# EAGLE schematic backplane (EAGLE 6.6.0)
AUTHOR: Pat Pannuto; REV: B; TITLE: Signpost Backplane

## Sheet 1 of 9
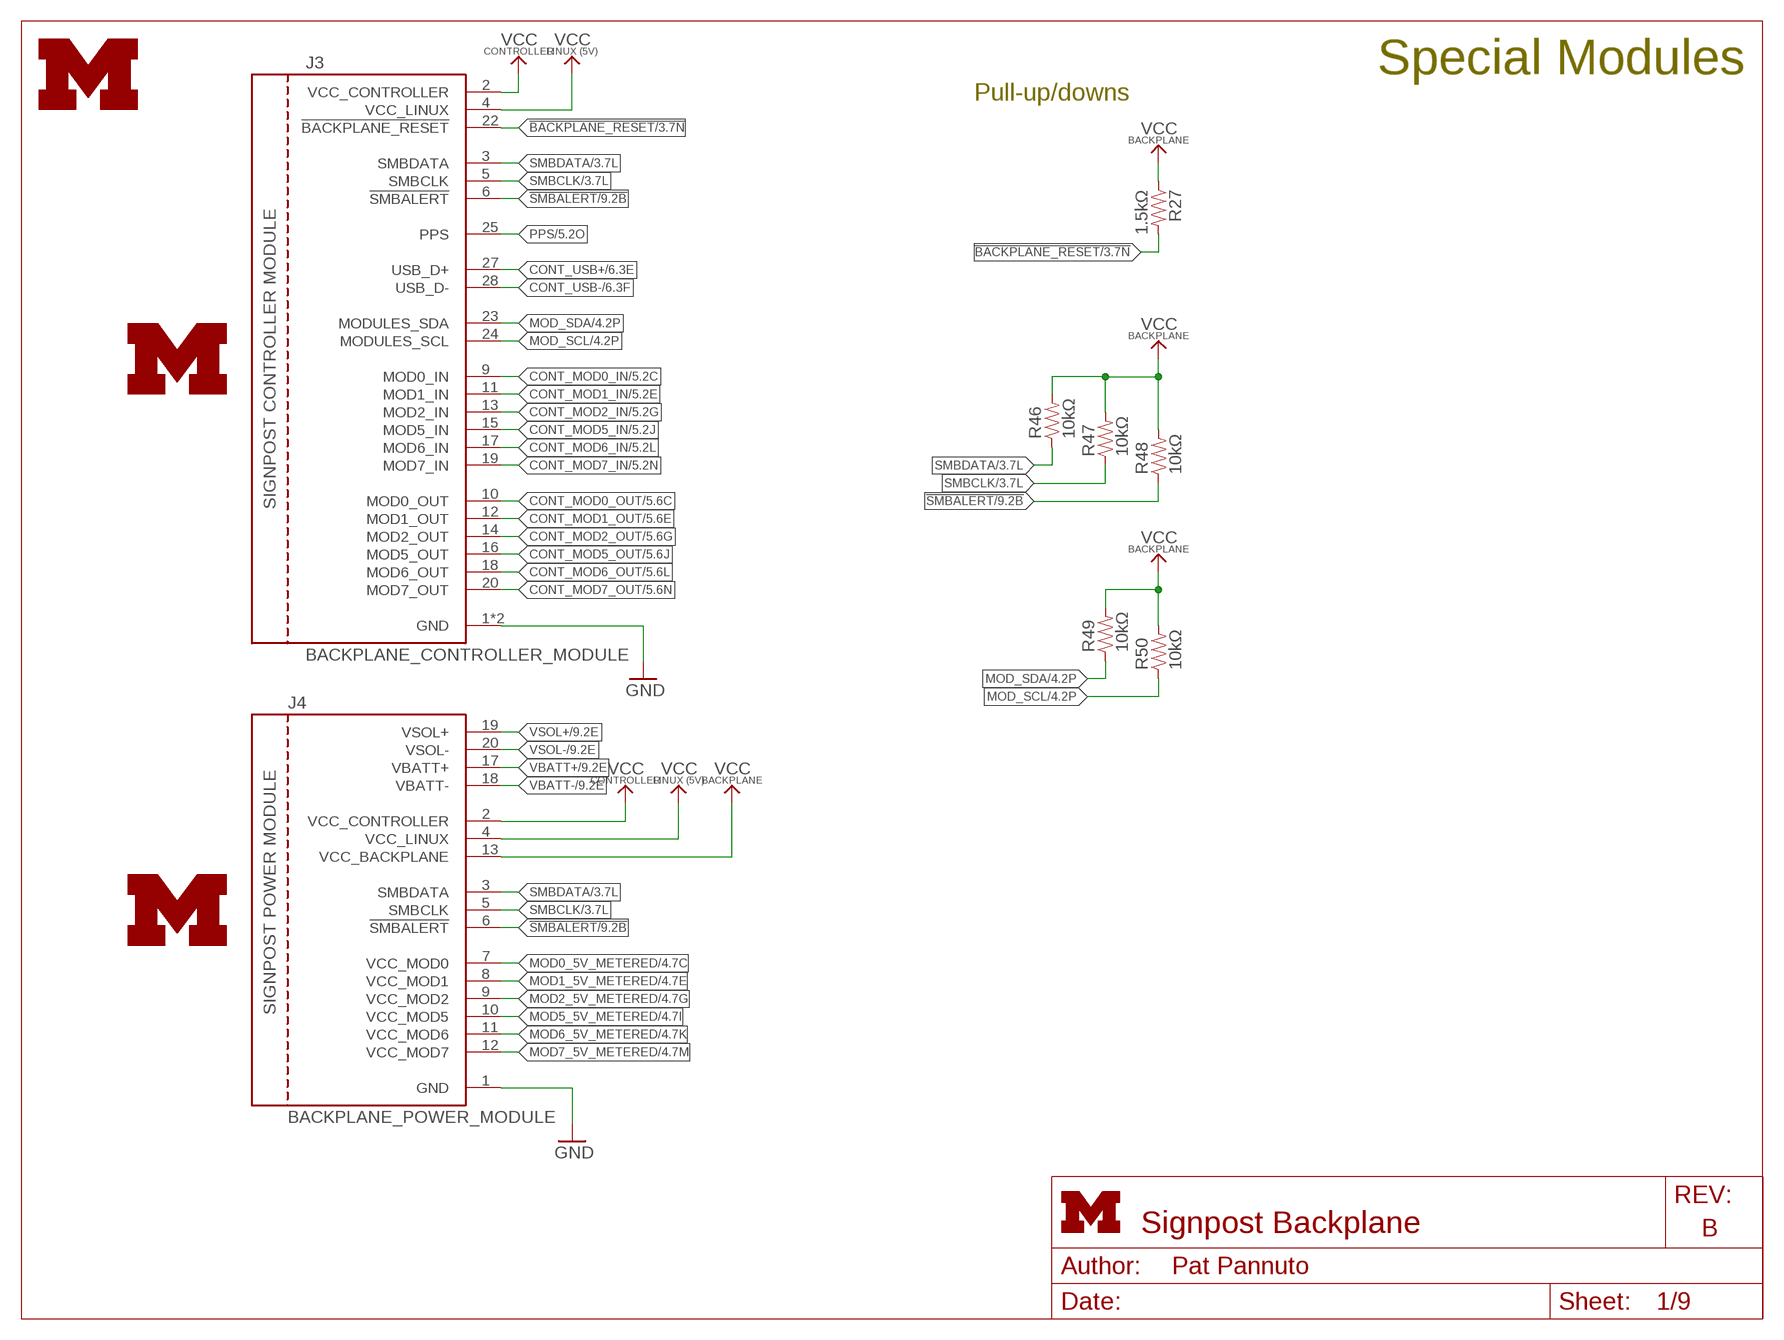
[diagram p0: schematic, sheet 1]
FRAME1 (LETTER_L): HEIGHT: 8.5in; WIDTH: 11in

### Parts
J3  BACKPLANE_CONTROLLER_MODULE  [BACKPLANE_MODULE_20PIN_10PIN]
J4  BACKPLANE_POWER_MODULE  [BACKPLANE_MODULE_20PIN]
LOGO1  UMICH_SOLID_GIANT  [UMICH_SOLID_1000MIL]
LOGO8  UMICH_SOLID_MEDIUM  [UMICH_SOLID_200MIL]
LOGO9  UMICH_SOLID_MEDIUM  [UMICH_SOLID_200MIL]
R27  1.5kΩ  RESISTOR0603_RES  [0603-RES]
R46  10kΩ  RESISTOR0603_RES  [0603-RES]
R47  10kΩ  RESISTOR0603_RES  [0603-RES]
R48  10kΩ  RESISTOR0603_RES  [0603-RES]
R49  10kΩ  RESISTOR0603_RES  [0603-RES]
R50  10kΩ  RESISTOR0603_RES  [0603-RES]

### Nets
!BACKPLANE_RESET: J3.22(!BACKPLANE_RESET) R27.2 ; also sheet 3,6,9
!SMBALERT: J3.6(!SMBALERT) J4.6(!SMBALERT) R48.1 ; also sheet 9
CONT_MOD0_IN: J3.9(MOD0_IN) ; also sheet 5
CONT_MOD0_OUT: J3.10(MOD0_OUT) ; also sheet 5
CONT_MOD1_IN: J3.11(MOD1_IN) ; also sheet 5
CONT_MOD1_OUT: J3.12(MOD1_OUT) ; also sheet 5
CONT_MOD2_IN: J3.13(MOD2_IN) ; also sheet 5
CONT_MOD2_OUT: J3.14(MOD2_OUT) ; also sheet 5
CONT_MOD5_IN: J3.15(MOD5_IN) ; also sheet 5
CONT_MOD5_OUT: J3.16(MOD5_OUT) ; also sheet 5
CONT_MOD6_IN: J3.17(MOD6_IN) ; also sheet 5
CONT_MOD6_OUT: J3.18(MOD6_OUT) ; also sheet 5
CONT_MOD7_IN: J3.19(MOD7_IN) ; also sheet 5
CONT_MOD7_OUT: J3.20(MOD7_OUT) ; also sheet 5
CONT_USB+: J3.27(USB_D+) ; also sheet 6
CONT_USB-: J3.28(USB_D-) ; also sheet 6
GND: J3.1(GND) J3.21(GND) J4.1(GND) ; also sheet 2,3,4,5,6,7,8,9
MOD0_5V_METERED: J4.7(VCC_MOD0) ; also sheet 4,8,9
MOD1_5V_METERED: J4.8(VCC_MOD1) ; also sheet 4,8,9
MOD2_5V_METERED: J4.9(VCC_MOD2) ; also sheet 4,8,9
MOD5_5V_METERED: J4.10(VCC_MOD5) ; also sheet 4,8,9
MOD6_5V_METERED: J4.11(VCC_MOD6) ; also sheet 4,8,9
MOD7_5V_METERED: J4.12(VCC_MOD7) ; also sheet 4,8,9
MOD_SCL: J3.24(MODULES_SCL) R50.1 ; also sheet 4,9
MOD_SDA: J3.23(MODULES_SDA) R49.1 ; also sheet 4,9
PPS: J3.25(PPS) ; also sheet 5,9
SMBCLK: J3.5(SMBCLK) J4.5(SMBCLK) R47.1 ; also sheet 3,9
SMBDATA: J3.3(SMBDATA) J4.3(SMBDATA) R46.1 ; also sheet 3,9
VBATT+: J4.17(VBATT+) ; also sheet 9
VBATT-: J4.18(VBATT-) ; also sheet 9
VCC_BACKPLANE: J4.13(VCC_BACKPLANE) R27.1 R46.2 R47.2 R48.2 R49.2 R50.2 ; also sheet 3,4,5,6,7,8,9
VCC_CONTROLLER: J3.2(VCC_CONTROLLER) J4.2(VCC_CONTROLLER) ; also sheet 9
VCC_LINUX: J3.4(VCC_LINUX) J4.4(VCC_LINUX) ; also sheet 9
VSOL+: J4.19(VSOL+) ; also sheet 9
VSOL-: J4.20(VSOL-) ; also sheet 9

### Notes on the sheet
- Special Modules
- Pull-up/downs

## Sheet 2 of 9
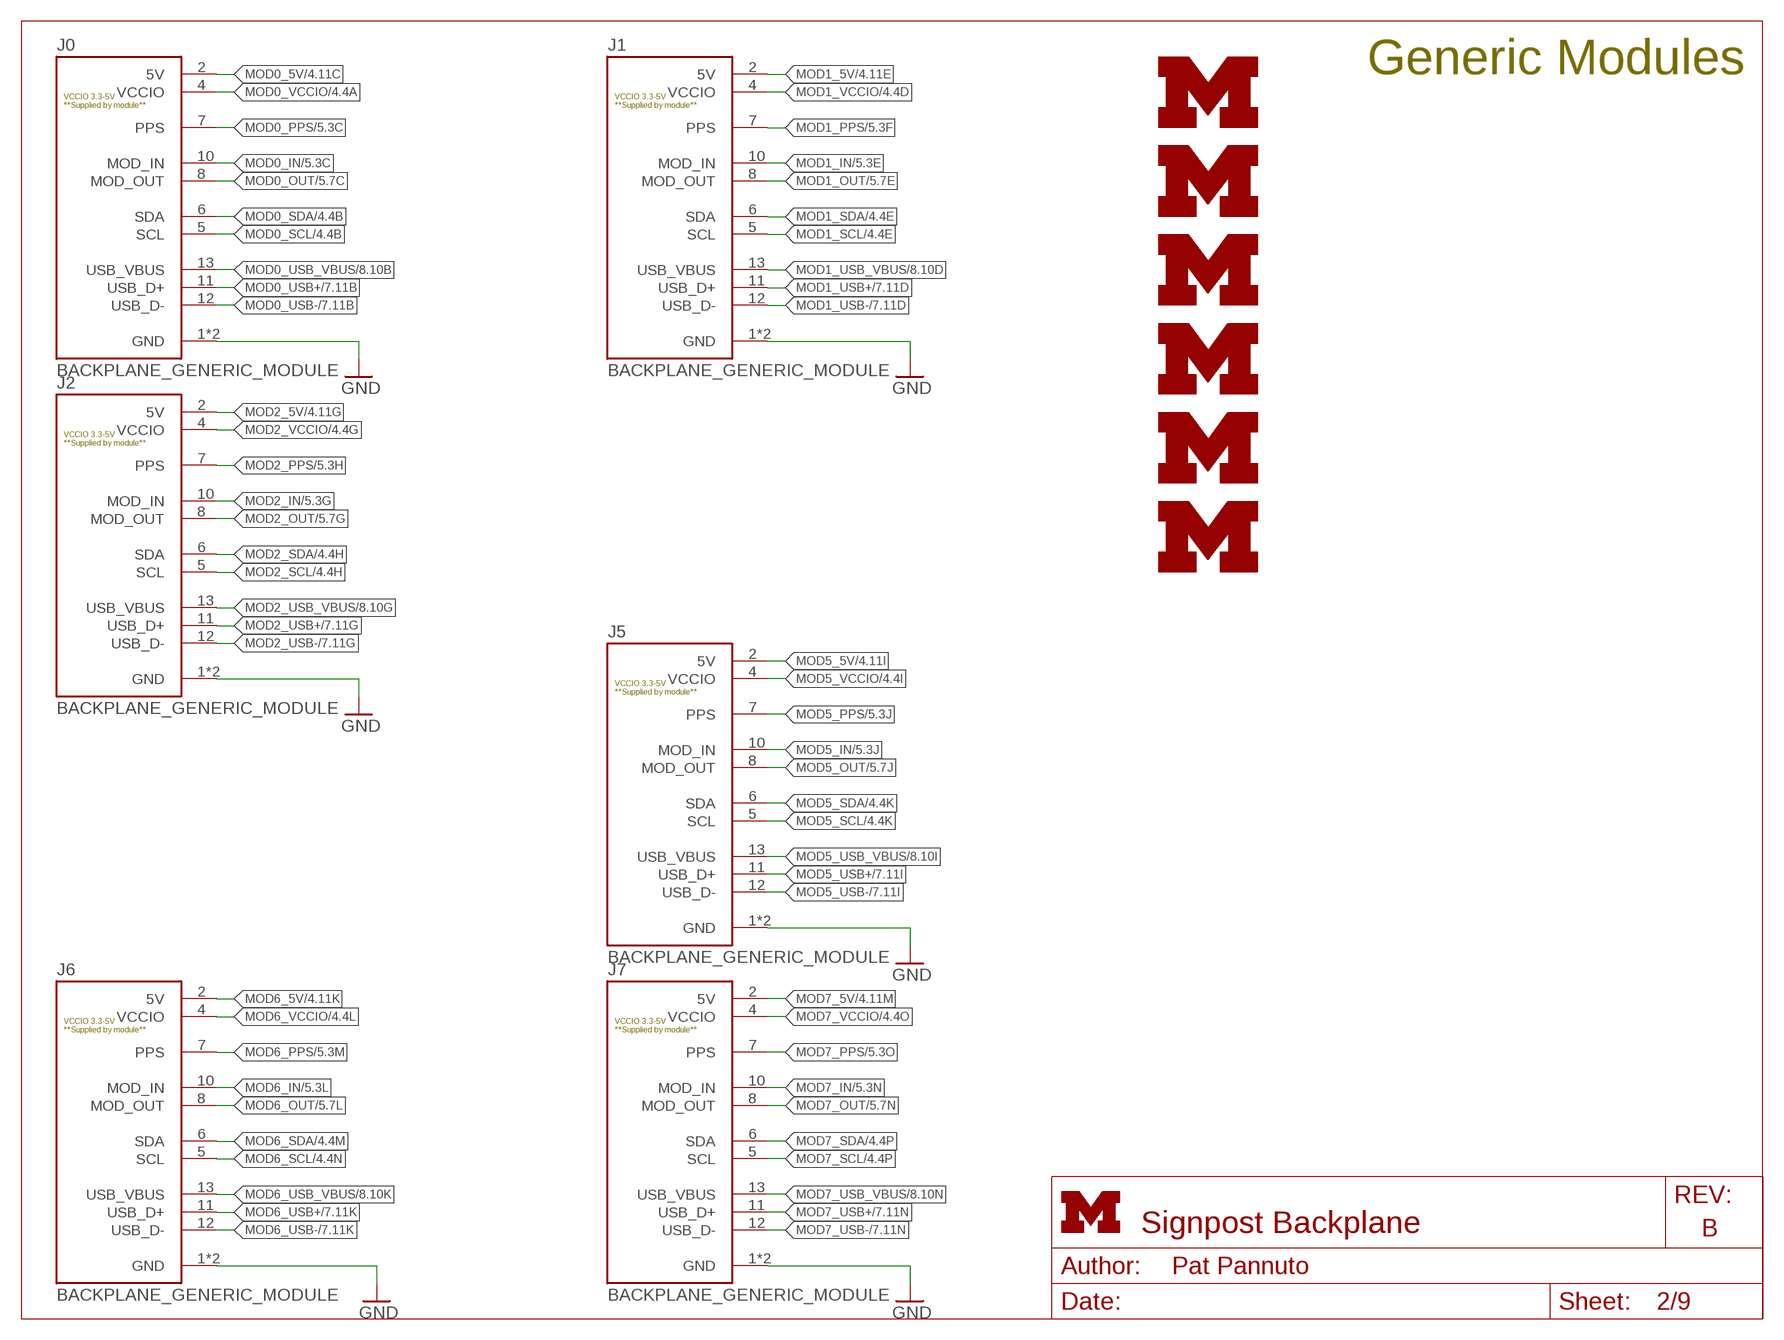
[diagram p1: schematic, sheet 2]
FRAME2 (LETTER_L): HEIGHT: 8.5in; WIDTH: 11in

### Parts
J0  BACKPLANE_GENERIC_MODULE  [BACKPLANE_MODULE_14PIN]
J1  BACKPLANE_GENERIC_MODULE  [BACKPLANE_MODULE_14PIN]
J2  BACKPLANE_GENERIC_MODULE  [BACKPLANE_MODULE_14PIN]
J5  BACKPLANE_GENERIC_MODULE  [BACKPLANE_MODULE_14PIN]
J6  BACKPLANE_GENERIC_MODULE  [BACKPLANE_MODULE_14PIN]
J7  BACKPLANE_GENERIC_MODULE  [BACKPLANE_MODULE_14PIN]
LOGO2  UMICH_SOLID_MEDIUM  [UMICH_SOLID_200MIL]
LOGO3  UMICH_SOLID_MEDIUM  [UMICH_SOLID_200MIL]
LOGO4  UMICH_SOLID_MEDIUM  [UMICH_SOLID_200MIL]
LOGO5  UMICH_SOLID_MEDIUM  [UMICH_SOLID_200MIL]
LOGO6  UMICH_SOLID_MEDIUM  [UMICH_SOLID_200MIL]
LOGO7  UMICH_SOLID_MEDIUM  [UMICH_SOLID_200MIL]

### Nets
GND: J0.1(GND) J0.14(GND) J1.1(GND) J1.14(GND) J2.1(GND) J2.14(GND) J5.1(GND) J5.14(GND) J6.1(GND) J6.14(GND) J7.1(GND) J7.14(GND) ; also sheet 1,3,4,5,6,7,8,9
MOD0_5V: J0.2(5V) ; also sheet 4
MOD0_IN: J0.10(MOD_IN) ; also sheet 5
MOD0_OUT: J0.8(MOD_OUT) ; also sheet 5
MOD0_PPS: J0.7(PPS) ; also sheet 5
MOD0_SCL: J0.5(SCL) ; also sheet 4
MOD0_SDA: J0.6(SDA) ; also sheet 4
MOD0_USB+: J0.11(USB_D+) ; also sheet 7
MOD0_USB-: J0.12(USB_D-) ; also sheet 7
MOD0_USB_VBUS: J0.13(USB_VBUS) ; also sheet 8
MOD0_VCCIO: J0.4(VCCIO) ; also sheet 4,5
MOD1_5V: J1.2(5V) ; also sheet 4
MOD1_IN: J1.10(MOD_IN) ; also sheet 5
MOD1_OUT: J1.8(MOD_OUT) ; also sheet 5
MOD1_PPS: J1.7(PPS) ; also sheet 5
MOD1_SCL: J1.5(SCL) ; also sheet 4
MOD1_SDA: J1.6(SDA) ; also sheet 4
MOD1_USB+: J1.11(USB_D+) ; also sheet 7
MOD1_USB-: J1.12(USB_D-) ; also sheet 7
MOD1_USB_VBUS: J1.13(USB_VBUS) ; also sheet 8
MOD1_VCCIO: J1.4(VCCIO) ; also sheet 4,5
MOD2_5V: J2.2(5V) ; also sheet 4
MOD2_IN: J2.10(MOD_IN) ; also sheet 5
MOD2_OUT: J2.8(MOD_OUT) ; also sheet 5
MOD2_PPS: J2.7(PPS) ; also sheet 5
MOD2_SCL: J2.5(SCL) ; also sheet 4
MOD2_SDA: J2.6(SDA) ; also sheet 4
MOD2_USB+: J2.11(USB_D+) ; also sheet 7
MOD2_USB-: J2.12(USB_D-) ; also sheet 7
MOD2_USB_VBUS: J2.13(USB_VBUS) ; also sheet 8
MOD2_VCCIO: J2.4(VCCIO) ; also sheet 4,5
MOD5_5V: J5.2(5V) ; also sheet 4
MOD5_IN: J5.10(MOD_IN) ; also sheet 5
MOD5_OUT: J5.8(MOD_OUT) ; also sheet 5
MOD5_PPS: J5.7(PPS) ; also sheet 5
MOD5_SCL: J5.5(SCL) ; also sheet 4
MOD5_SDA: J5.6(SDA) ; also sheet 4
MOD5_USB+: J5.11(USB_D+) ; also sheet 7
MOD5_USB-: J5.12(USB_D-) ; also sheet 7
MOD5_USB_VBUS: J5.13(USB_VBUS) ; also sheet 8
MOD5_VCCIO: J5.4(VCCIO) ; also sheet 4,5
MOD6_5V: J6.2(5V) ; also sheet 4
MOD6_IN: J6.10(MOD_IN) ; also sheet 5
MOD6_OUT: J6.8(MOD_OUT) ; also sheet 5
MOD6_PPS: J6.7(PPS) ; also sheet 5
MOD6_SCL: J6.5(SCL) ; also sheet 4
MOD6_SDA: J6.6(SDA) ; also sheet 4
MOD6_USB+: J6.11(USB_D+) ; also sheet 7
MOD6_USB-: J6.12(USB_D-) ; also sheet 7
MOD6_USB_VBUS: J6.13(USB_VBUS) ; also sheet 8
MOD6_VCCIO: J6.4(VCCIO) ; also sheet 4,5
MOD7_5V: J7.2(5V) ; also sheet 4
MOD7_IN: J7.10(MOD_IN) ; also sheet 5
MOD7_OUT: J7.8(MOD_OUT) ; also sheet 5
MOD7_PPS: J7.7(PPS) ; also sheet 5
MOD7_SCL: J7.5(SCL) ; also sheet 4
MOD7_SDA: J7.6(SDA) ; also sheet 4
MOD7_USB+: J7.11(USB_D+) ; also sheet 7
MOD7_USB-: J7.12(USB_D-) ; also sheet 7
MOD7_USB_VBUS: J7.13(USB_VBUS) ; also sheet 8
MOD7_VCCIO: J7.4(VCCIO) ; also sheet 4,5

### Notes on the sheet
- Generic Modules

## Sheet 3 of 9
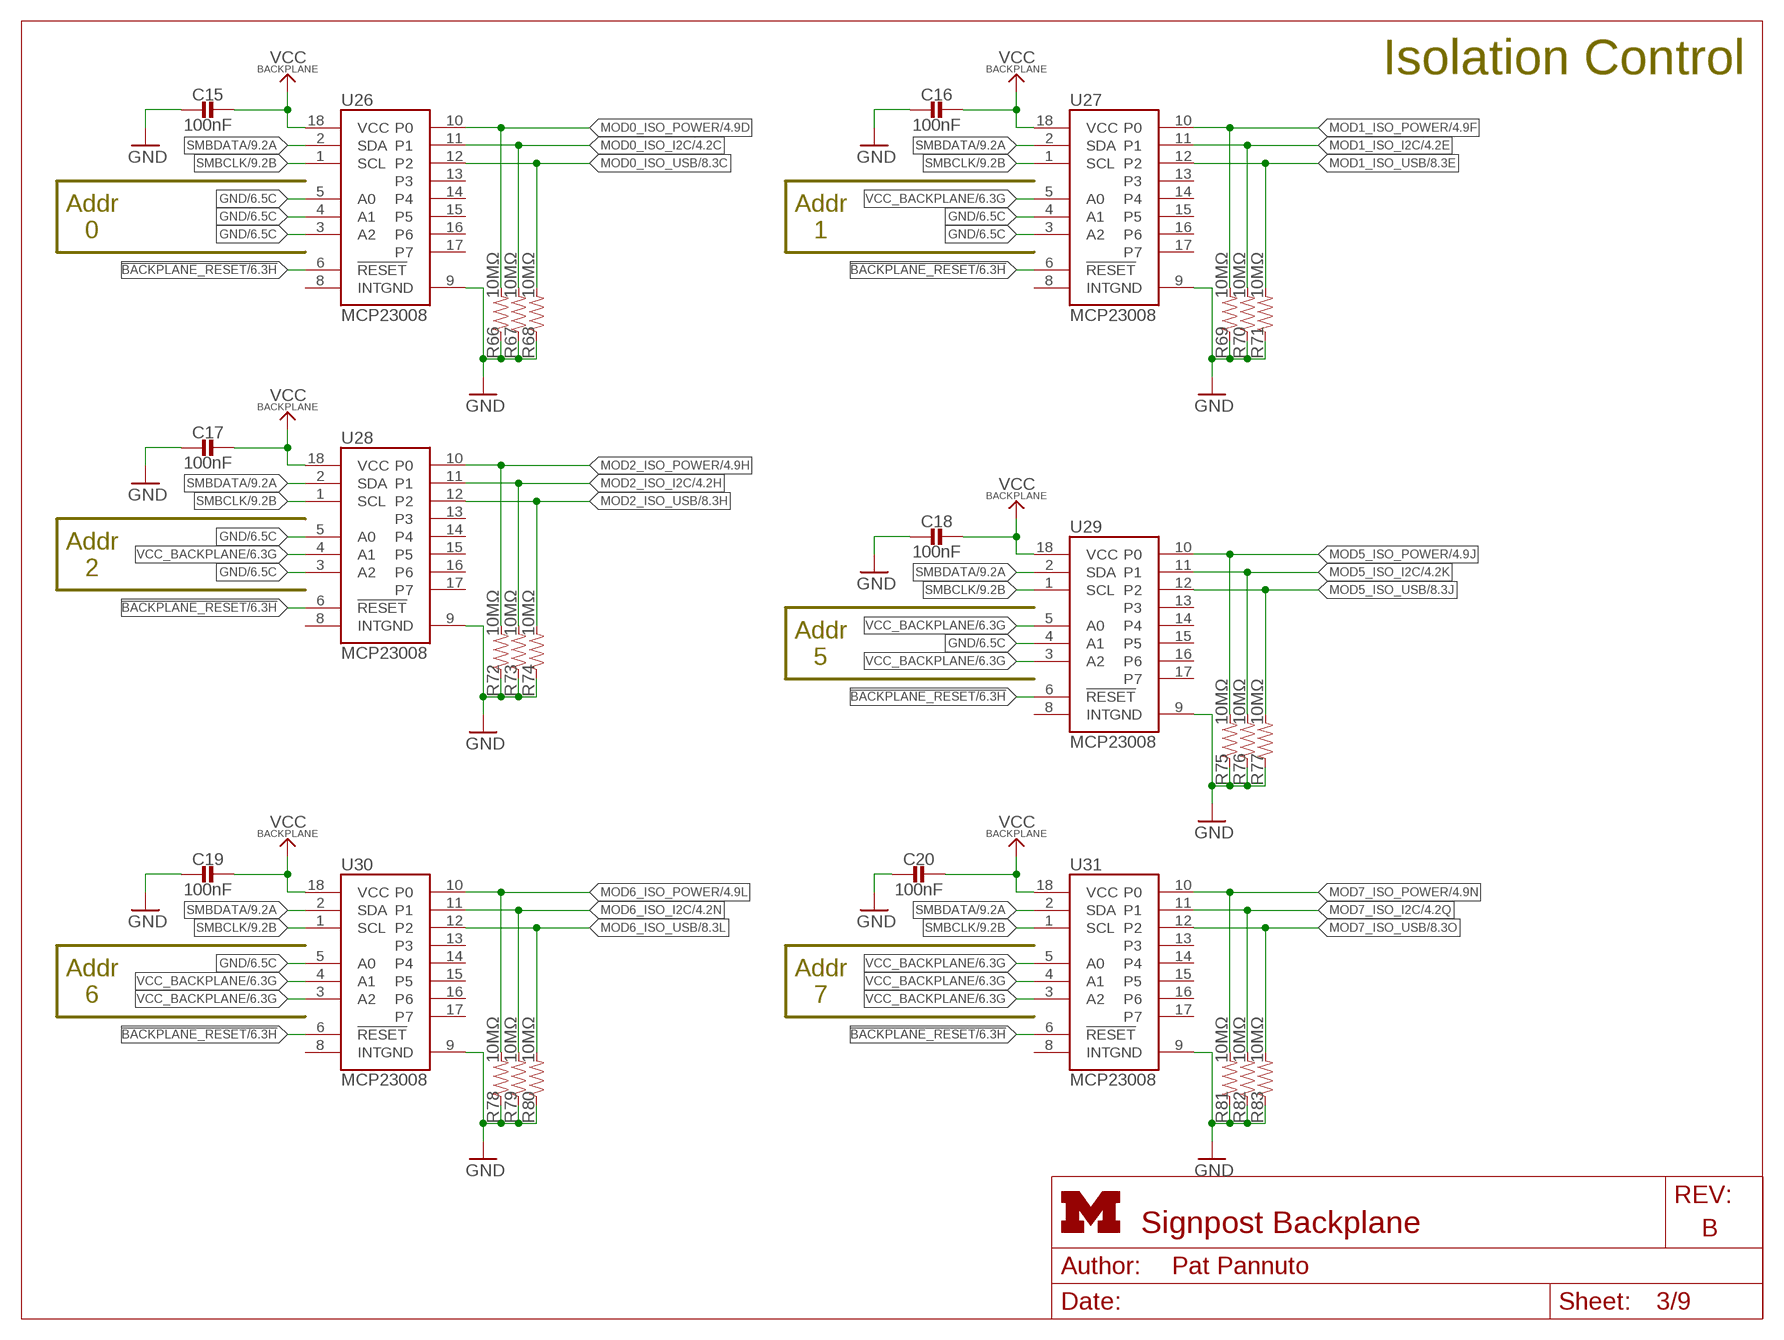
[diagram p2: schematic, sheet 3]
FRAME7 (LETTER_L_UMICH): HEIGHT: 8.5in; WIDTH: 11in

### Parts
C15  100nF  CAPACITOR0603_CAP  [0603_CAP]
C16  100nF  CAPACITOR0603_CAP  [0603_CAP]
C17  100nF  CAPACITOR0603_CAP  [0603_CAP]
C18  100nF  CAPACITOR0603_CAP  [0603_CAP]
C19  100nF  CAPACITOR0603_CAP  [0603_CAP]
C20  100nF  CAPACITOR0603_CAP  [0603_CAP]
R66  10MΩ  RESISTOR0603_RES  [0603-RES]
R67  10MΩ  RESISTOR0603_RES  [0603-RES]
R68  10MΩ  RESISTOR0603_RES  [0603-RES]
R69  10MΩ  RESISTOR0603_RES  [0603-RES]
R70  10MΩ  RESISTOR0603_RES  [0603-RES]
R71  10MΩ  RESISTOR0603_RES  [0603-RES]
R72  10MΩ  RESISTOR0603_RES  [0603-RES]
R73  10MΩ  RESISTOR0603_RES  [0603-RES]
R74  10MΩ  RESISTOR0603_RES  [0603-RES]
R75  10MΩ  RESISTOR0603_RES  [0603-RES]
R76  10MΩ  RESISTOR0603_RES  [0603-RES]
R77  10MΩ  RESISTOR0603_RES  [0603-RES]
R78  10MΩ  RESISTOR0603_RES  [0603-RES]
R79  10MΩ  RESISTOR0603_RES  [0603-RES]
R80  10MΩ  RESISTOR0603_RES  [0603-RES]
R81  10MΩ  RESISTOR0603_RES  [0603-RES]
R82  10MΩ  RESISTOR0603_RES  [0603-RES]
R83  10MΩ  RESISTOR0603_RES  [0603-RES]
U26  MCP23008  [SOIC-18]
U27  MCP23008  [SOIC-18]
U28  MCP23008  [SOIC-18]
U29  MCP23008  [SOIC-18]
U30  MCP23008  [SOIC-18]
U31  MCP23008  [SOIC-18]

### Nets
!BACKPLANE_RESET: U26.6(!RESET) U27.6(!RESET) U28.6(!RESET) U29.6(!RESET) U30.6(!RESET) U31.6(!RESET) ; also sheet 1,6,9
GND: C15.2 C16.2 C17.2 C18.2 C19.2 C20.2 R66.1 R67.1 R68.1 R69.1 R70.1 R71.1 R72.1 R73.1 R74.1 R75.1 R76.1 R77.1 R78.1 R79.1 R80.1 R81.1 R82.1 R83.1 U26.3(A2) U26.4(A1) U26.5(A0) U26.9(GND) U27.3(A2) U27.4(A1) U27.9(GND) U28.3(A2) U28.5(A0) U28.9(GND) U29.4(A1) U29.9(GND) U30.5(A0) U30.9(GND) U31.9(GND) ; also sheet 1,2,4,5,6,7,8,9
MOD0_ISO_I2C: R67.2 U26.11(P1) ; also sheet 4,9
MOD0_ISO_POWER: R66.2 U26.10(P0) ; also sheet 4,9
MOD0_ISO_USB: R68.2 U26.12(P2) ; also sheet 8,9
MOD1_ISO_I2C: R70.2 U27.11(P1) ; also sheet 4,9
MOD1_ISO_POWER: R69.2 U27.10(P0) ; also sheet 4,9
MOD1_ISO_USB: R71.2 U27.12(P2) ; also sheet 8,9
MOD2_ISO_I2C: R73.2 U28.11(P1) ; also sheet 4,9
MOD2_ISO_POWER: R72.2 U28.10(P0) ; also sheet 4,9
MOD2_ISO_USB: R74.2 U28.12(P2) ; also sheet 8,9
MOD5_ISO_I2C: R76.2 U29.11(P1) ; also sheet 4,9
MOD5_ISO_POWER: R75.2 U29.10(P0) ; also sheet 4,9
MOD5_ISO_USB: R77.2 U29.12(P2) ; also sheet 8,9
MOD6_ISO_I2C: R79.2 U30.11(P1) ; also sheet 4,9
MOD6_ISO_POWER: R78.2 U30.10(P0) ; also sheet 4,9
MOD6_ISO_USB: R80.2 U30.12(P2) ; also sheet 8,9
MOD7_ISO_I2C: R82.2 U31.11(P1) ; also sheet 4,9
MOD7_ISO_POWER: R81.2 U31.10(P0) ; also sheet 4,9
MOD7_ISO_USB: R83.2 U31.12(P2) ; also sheet 8,9
SMBCLK: U26.1(SCL) U27.1(SCL) U28.1(SCL) U29.1(SCL) U30.1(SCL) U31.1(SCL) ; also sheet 1,9
SMBDATA: U26.2(SDA) U27.2(SDA) U28.2(SDA) U29.2(SDA) U30.2(SDA) U31.2(SDA) ; also sheet 1,9
VCC_BACKPLANE: C15.1 C16.1 C17.1 C18.1 C19.1 C20.1 U26.18(VCC) U27.5(A0) U27.18(VCC) U28.4(A1) U28.18(VCC) U29.3(A2) U29.5(A0) U29.18(VCC) U30.3(A2) U30.4(A1) U30.18(VCC) U31.3(A2) U31.4(A1) U31.5(A0) U31.18(VCC) ; also sheet 1,4,5,6,7,8,9
Unconnected: U26.8(INT) U26.13(P3) U26.14(P4) U26.15(P5) U26.16(P6) U26.17(P7) U27.8(INT) U27.13(P3) U27.14(P4) U27.15(P5) U27.16(P6) U27.17(P7) U28.8(INT) U28.13(P3) U28.14(P4) U28.15(P5) U28.16(P6) U28.17(P7) U29.8(INT) U29.13(P3) U29.14(P4) U29.15(P5) U29.16(P6) U29.17(P7) U30.8(INT) U30.13(P3) U30.14(P4) U30.15(P5) U30.16(P6) U30.17(P7) U31.8(INT) U31.13(P3) U31.14(P4) U31.15(P5) U31.16(P6) U31.17(P7)

### Notes on the sheet
- Isolation Control
- Addr
  0
- Addr
  1
- Addr
  2
- Addr
  5
- Addr
  6
- Addr
  7

## Sheet 4 of 9
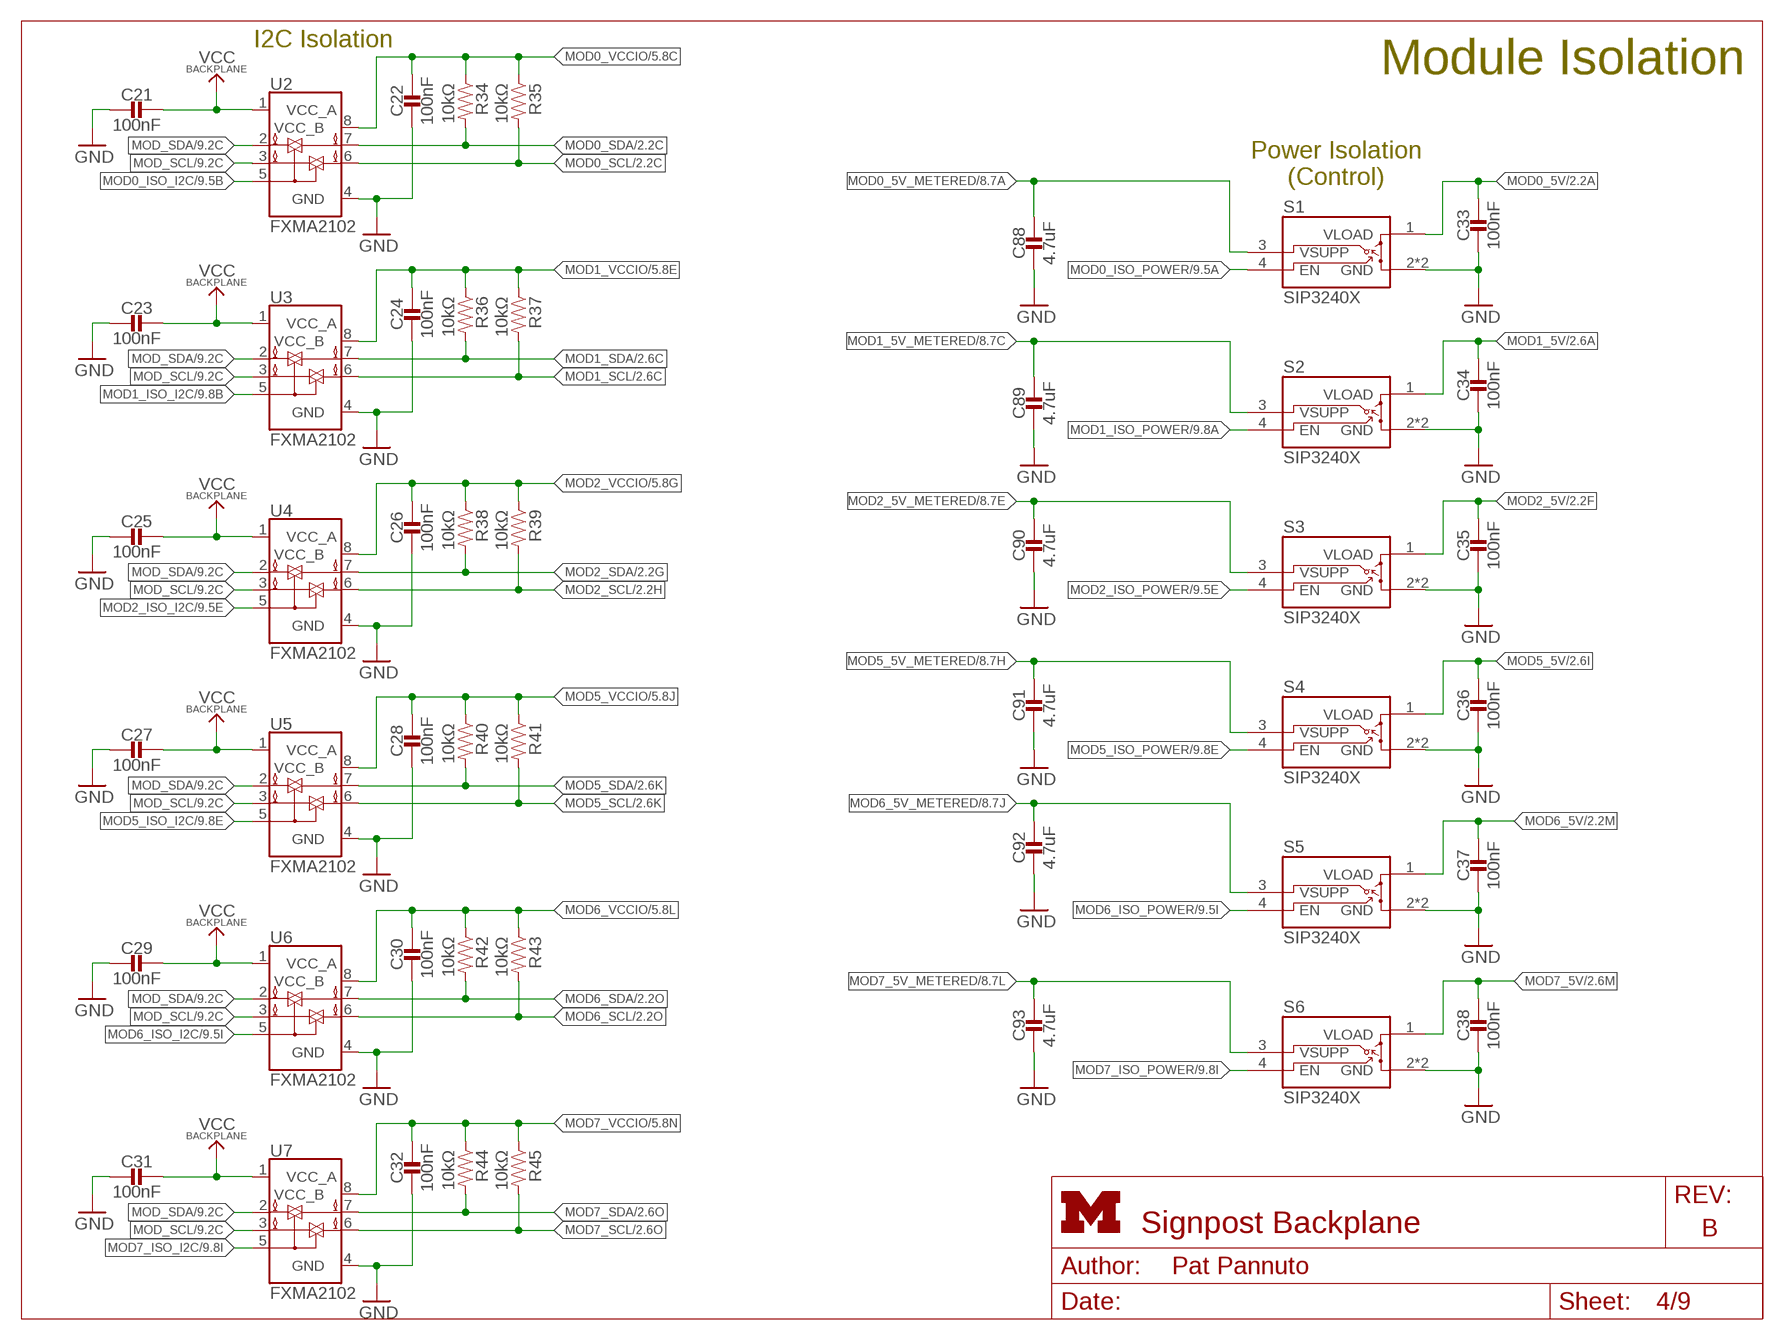
[diagram p3: schematic, sheet 4]
FRAME4 (LETTER_L): HEIGHT: 8.5in; WIDTH: 11in

### Parts
C21  100nF  CAPACITOR0603_CAP  [0603_CAP]
C22  100nF  CAPACITOR0603_CAP  [0603_CAP]
C23  100nF  CAPACITOR0603_CAP  [0603_CAP]
C24  100nF  CAPACITOR0603_CAP  [0603_CAP]
C25  100nF  CAPACITOR0603_CAP  [0603_CAP]
C26  100nF  CAPACITOR0603_CAP  [0603_CAP]
C27  100nF  CAPACITOR0603_CAP  [0603_CAP]
C28  100nF  CAPACITOR0603_CAP  [0603_CAP]
C29  100nF  CAPACITOR0603_CAP  [0603_CAP]
C30  100nF  CAPACITOR0603_CAP  [0603_CAP]
C31  100nF  CAPACITOR0603_CAP  [0603_CAP]
C32  100nF  CAPACITOR0603_CAP  [0603_CAP]
C33  100nF  CAPACITOR0603_CAP  [0603_CAP]
C34  100nF  CAPACITOR0603_CAP  [0603_CAP]
C35  100nF  CAPACITOR0603_CAP  [0603_CAP]
C36  100nF  CAPACITOR0603_CAP  [0603_CAP]
C37  100nF  CAPACITOR0603_CAP  [0603_CAP]
C38  100nF  CAPACITOR0603_CAP  [0603_CAP]
C88  4.7uF  CAPACITOR0603_CAP  [0603_CAP]
C89  4.7uF  CAPACITOR0603_CAP  [0603_CAP]
C90  4.7uF  CAPACITOR0603_CAP  [0603_CAP]
C91  4.7uF  CAPACITOR0603_CAP  [0603_CAP]
C92  4.7uF  CAPACITOR0603_CAP  [0603_CAP]
C93  4.7uF  CAPACITOR0603_CAP  [0603_CAP]
R34  10kΩ  RESISTOR0603_RES  [0603-RES]
R35  10kΩ  RESISTOR0603_RES  [0603-RES]
R36  10kΩ  RESISTOR0603_RES  [0603-RES]
R37  10kΩ  RESISTOR0603_RES  [0603-RES]
R38  10kΩ  RESISTOR0603_RES  [0603-RES]
R39  10kΩ  RESISTOR0603_RES  [0603-RES]
R40  10kΩ  RESISTOR0603_RES  [0603-RES]
R41  10kΩ  RESISTOR0603_RES  [0603-RES]
R42  10kΩ  RESISTOR0603_RES  [0603-RES]
R43  10kΩ  RESISTOR0603_RES  [0603-RES]
R44  10kΩ  RESISTOR0603_RES  [0603-RES]
R45  10kΩ  RESISTOR0603_RES  [0603-RES]
S1  SIP3240X  [TDFN4]
S2  SIP3240X  [TDFN4]
S3  SIP3240X  [TDFN4]
S4  SIP3240X  [TDFN4]
S5  SIP3240X  [TDFN4]
S6  SIP3240X  [TDFN4]
U2  FXMA2102  [UMLP-8]
U3  FXMA2102  [UMLP-8]
U4  FXMA2102  [UMLP-8]
U5  FXMA2102  [UMLP-8]
U6  FXMA2102  [UMLP-8]
U7  FXMA2102  [UMLP-8]

### Nets
GND: C21.2 C22.2 C23.2 C24.2 C25.2 C26.2 C27.2 C28.2 C29.2 C30.2 C31.2 C32.2 C33.2 C34.2 C35.2 C36.2 C37.2 C38.2 C88.2 C89.2 C90.2 C91.2 C92.2 C93.2 S1.2(GND) S1.PAD(GND) S2.2(GND) S2.PAD(GND) S3.2(GND) S3.PAD(GND) S4.2(GND) S4.PAD(GND) S5.2(GND) S5.PAD(GND) S6.2(GND) S6.PAD(GND) U2.4(GND) U3.4(GND) U4.4(GND) U5.4(GND) U6.4(GND) U7.4(GND) ; also sheet 1,2,3,5,6,7,8,9
MOD0_5V: C33.1 S1.1(VLOAD) ; also sheet 2
MOD0_5V_METERED: C88.1 S1.3(VSUPP) ; also sheet 1,8,9
MOD0_ISO_I2C: U2.5(OE) ; also sheet 3,9
MOD0_ISO_POWER: S1.4(EN) ; also sheet 3,9
MOD0_SCL: R35.2 U2.6(B1) ; also sheet 2
MOD0_SDA: R34.2 U2.7(B0) ; also sheet 2
MOD0_VCCIO: C22.1 R34.1 R35.1 U2.8(VCC_B) ; also sheet 2,5
MOD1_5V: C34.1 S2.1(VLOAD) ; also sheet 2
MOD1_5V_METERED: C89.1 S2.3(VSUPP) ; also sheet 1,8,9
MOD1_ISO_I2C: U3.5(OE) ; also sheet 3,9
MOD1_ISO_POWER: S2.4(EN) ; also sheet 3,9
MOD1_SCL: R37.2 U3.6(B1) ; also sheet 2
MOD1_SDA: R36.2 U3.7(B0) ; also sheet 2
MOD1_VCCIO: C24.1 R36.1 R37.1 U3.8(VCC_B) ; also sheet 2,5
MOD2_5V: C35.1 S3.1(VLOAD) ; also sheet 2
MOD2_5V_METERED: C90.1 S3.3(VSUPP) ; also sheet 1,8,9
MOD2_ISO_I2C: U4.5(OE) ; also sheet 3,9
MOD2_ISO_POWER: S3.4(EN) ; also sheet 3,9
MOD2_SCL: R39.2 U4.6(B1) ; also sheet 2
MOD2_SDA: R38.2 U4.7(B0) ; also sheet 2
MOD2_VCCIO: C26.1 R38.1 R39.1 U4.8(VCC_B) ; also sheet 2,5
MOD5_5V: C36.1 S4.1(VLOAD) ; also sheet 2
MOD5_5V_METERED: C91.1 S4.3(VSUPP) ; also sheet 1,8,9
MOD5_ISO_I2C: U5.5(OE) ; also sheet 3,9
MOD5_ISO_POWER: S4.4(EN) ; also sheet 3,9
MOD5_SCL: R41.2 U5.6(B1) ; also sheet 2
MOD5_SDA: R40.2 U5.7(B0) ; also sheet 2
MOD5_VCCIO: C28.1 R40.1 R41.1 U5.8(VCC_B) ; also sheet 2,5
MOD6_5V: C37.1 S5.1(VLOAD) ; also sheet 2
MOD6_5V_METERED: C92.1 S5.3(VSUPP) ; also sheet 1,8,9
MOD6_ISO_I2C: U6.5(OE) ; also sheet 3,9
MOD6_ISO_POWER: S5.4(EN) ; also sheet 3,9
MOD6_SCL: R43.2 U6.6(B1) ; also sheet 2
MOD6_SDA: R42.2 U6.7(B0) ; also sheet 2
MOD6_VCCIO: C30.1 R42.1 R43.1 U6.8(VCC_B) ; also sheet 2,5
MOD7_5V: C38.1 S6.1(VLOAD) ; also sheet 2
MOD7_5V_METERED: C93.1 S6.3(VSUPP) ; also sheet 1,8,9
MOD7_ISO_I2C: U7.5(OE) ; also sheet 3,9
MOD7_ISO_POWER: S6.4(EN) ; also sheet 3,9
MOD7_SCL: R45.2 U7.6(B1) ; also sheet 2
MOD7_SDA: R44.2 U7.7(B0) ; also sheet 2
MOD7_VCCIO: C32.1 R44.1 R45.1 U7.8(VCC_B) ; also sheet 2,5
MOD_SCL: U2.3(A1) U3.3(A1) U4.3(A1) U5.3(A1) U6.3(A1) U7.3(A1) ; also sheet 1,9
MOD_SDA: U2.2(A0) U3.2(A0) U4.2(A0) U5.2(A0) U6.2(A0) U7.2(A0) ; also sheet 1,9
VCC_BACKPLANE: C21.1 C23.1 C25.1 C27.1 C29.1 C31.1 U2.1(VCC_A) U3.1(VCC_A) U4.1(VCC_A) U5.1(VCC_A) U6.1(VCC_A) U7.1(VCC_A) ; also sheet 1,3,5,6,7,8,9

### Notes on the sheet
- I2C Isolation | Module Isolation
- Power Isolation
  (Control)

## Sheet 5 of 9
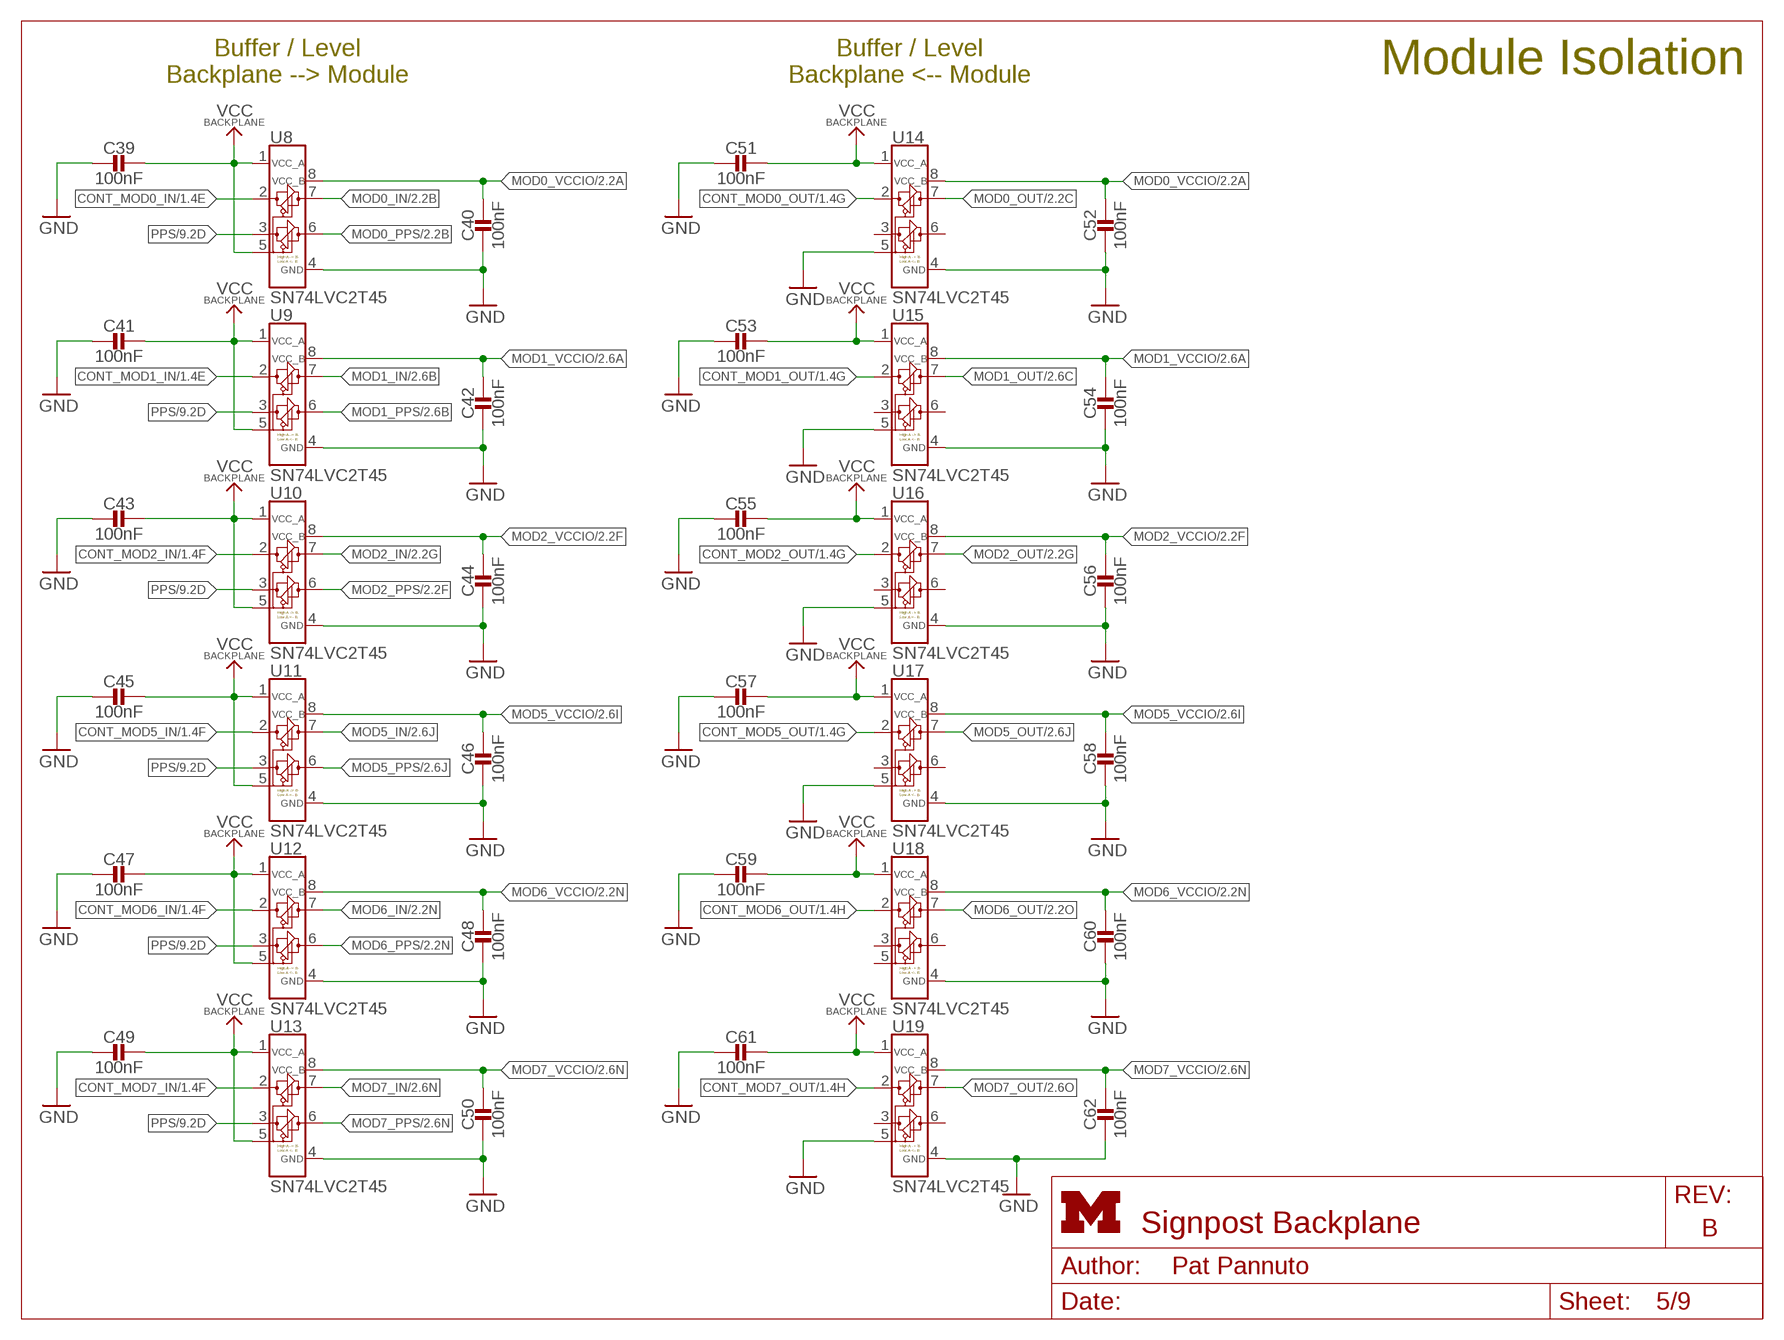
[diagram p4: schematic, sheet 5]
FRAME5 (LETTER_L_UMICH): HEIGHT: 8.5in; WIDTH: 11in

### Parts
C39  100nF  CAPACITOR0603_CAP  [0603_CAP]
C40  100nF  CAPACITOR0603_CAP  [0603_CAP]
C41  100nF  CAPACITOR0603_CAP  [0603_CAP]
C42  100nF  CAPACITOR0603_CAP  [0603_CAP]
C43  100nF  CAPACITOR0603_CAP  [0603_CAP]
C44  100nF  CAPACITOR0603_CAP  [0603_CAP]
C45  100nF  CAPACITOR0603_CAP  [0603_CAP]
C46  100nF  CAPACITOR0603_CAP  [0603_CAP]
C47  100nF  CAPACITOR0603_CAP  [0603_CAP]
C48  100nF  CAPACITOR0603_CAP  [0603_CAP]
C49  100nF  CAPACITOR0603_CAP  [0603_CAP]
C50  100nF  CAPACITOR0603_CAP  [0603_CAP]
C51  100nF  CAPACITOR0603_CAP  [0603_CAP]
C52  100nF  CAPACITOR0603_CAP  [0603_CAP]
C53  100nF  CAPACITOR0603_CAP  [0603_CAP]
C54  100nF  CAPACITOR0603_CAP  [0603_CAP]
C55  100nF  CAPACITOR0603_CAP  [0603_CAP]
C56  100nF  CAPACITOR0603_CAP  [0603_CAP]
C57  100nF  CAPACITOR0603_CAP  [0603_CAP]
C58  100nF  CAPACITOR0603_CAP  [0603_CAP]
C59  100nF  CAPACITOR0603_CAP  [0603_CAP]
C60  100nF  CAPACITOR0603_CAP  [0603_CAP]
C61  100nF  CAPACITOR0603_CAP  [0603_CAP]
C62  100nF  CAPACITOR0603_CAP  [0603_CAP]
U8  SN74LVC2T45  [VFSOP-8]
U9  SN74LVC2T45  [VFSOP-8]
U10  SN74LVC2T45  [VFSOP-8]
U11  SN74LVC2T45  [VFSOP-8]
U12  SN74LVC2T45  [VFSOP-8]
U13  SN74LVC2T45  [VFSOP-8]
U14  SN74LVC2T45  [VFSOP-8]
U15  SN74LVC2T45  [VFSOP-8]
U16  SN74LVC2T45  [VFSOP-8]
U17  SN74LVC2T45  [VFSOP-8]
U18  SN74LVC2T45  [VFSOP-8]
U19  SN74LVC2T45  [VFSOP-8]

### Nets
CONT_MOD0_IN: U8.2(A1) ; also sheet 1
CONT_MOD0_OUT: U14.2(A1) ; also sheet 1
CONT_MOD1_IN: U9.2(A1) ; also sheet 1
CONT_MOD1_OUT: U15.2(A1) ; also sheet 1
CONT_MOD2_IN: U10.2(A1) ; also sheet 1
CONT_MOD2_OUT: U16.2(A1) ; also sheet 1
CONT_MOD5_IN: U11.2(A1) ; also sheet 1
CONT_MOD5_OUT: U17.2(A1) ; also sheet 1
CONT_MOD6_IN: U12.2(A1) ; also sheet 1
CONT_MOD6_OUT: U18.2(A1) ; also sheet 1
CONT_MOD7_IN: U13.2(A1) ; also sheet 1
CONT_MOD7_OUT: U19.2(A1) ; also sheet 1
GND: C39.2 C40.2 C41.2 C42.2 C43.2 C44.2 C45.2 C46.2 C47.2 C48.2 C49.2 C50.2 C51.2 C52.2 C53.2 C54.2 C55.2 C56.2 C57.2 C58.2 C59.2 C60.2 C61.2 C62.2 U8.4(GND) U9.4(GND) U10.4(GND) U11.4(GND) U12.4(GND) U13.4(GND) U14.4(GND) U14.5(DIR) U15.4(GND) U15.5(DIR) U16.4(GND) U16.5(DIR) U17.4(GND) U17.5(DIR) U18.4(GND) U19.4(GND) U19.5(DIR) ; also sheet 1,2,3,4,6,7,8,9
MOD0_IN: U8.7(B1) ; also sheet 2
MOD0_OUT: U14.7(B1) ; also sheet 2
MOD0_PPS: U8.6(B2) ; also sheet 2
MOD0_VCCIO: C40.1 C52.1 U8.8(VCC_B) U14.8(VCC_B) ; also sheet 2,4
MOD1_IN: U9.7(B1) ; also sheet 2
MOD1_OUT: U15.7(B1) ; also sheet 2
MOD1_PPS: U9.6(B2) ; also sheet 2
MOD1_VCCIO: C42.1 C54.1 U9.8(VCC_B) U15.8(VCC_B) ; also sheet 2,4
MOD2_IN: U10.7(B1) ; also sheet 2
MOD2_OUT: U16.7(B1) ; also sheet 2
MOD2_PPS: U10.6(B2) ; also sheet 2
MOD2_VCCIO: C44.1 C56.1 U10.8(VCC_B) U16.8(VCC_B) ; also sheet 2,4
MOD5_IN: U11.7(B1) ; also sheet 2
MOD5_OUT: U17.7(B1) ; also sheet 2
MOD5_PPS: U11.6(B2) ; also sheet 2
MOD5_VCCIO: C46.1 C58.1 U11.8(VCC_B) U17.8(VCC_B) ; also sheet 2,4
MOD6_IN: U12.7(B1) ; also sheet 2
MOD6_OUT: U18.7(B1) ; also sheet 2
MOD6_PPS: U12.6(B2) ; also sheet 2
MOD6_VCCIO: C48.1 C60.1 U12.8(VCC_B) U18.8(VCC_B) ; also sheet 2,4
MOD7_IN: U13.7(B1) ; also sheet 2
MOD7_OUT: U19.7(B1) ; also sheet 2
MOD7_PPS: U13.6(B2) ; also sheet 2
MOD7_VCCIO: C50.1 C62.1 U13.8(VCC_B) U19.8(VCC_B) ; also sheet 2,4
PPS: U8.3(A2) U9.3(A2) U10.3(A2) U11.3(A2) U12.3(A2) U13.3(A2) ; also sheet 1,9
VCC_BACKPLANE: C39.1 C41.1 C43.1 C45.1 C47.1 C49.1 C51.1 C53.1 C55.1 C57.1 C59.1 C61.1 U8.1(VCC_A) U8.5(DIR) U9.1(VCC_A) U9.5(DIR) U10.1(VCC_A) U10.5(DIR) U11.1(VCC_A) U11.5(DIR) U12.1(VCC_A) U12.5(DIR) U13.1(VCC_A) U13.5(DIR) U14.1(VCC_A) U15.1(VCC_A) U16.1(VCC_A) U17.1(VCC_A) U18.1(VCC_A) U19.1(VCC_A) ; also sheet 1,3,4,6,7,8,9
Unconnected: U14.3(A2) U14.6(B2) U15.3(A2) U15.6(B2) U16.3(A2) U16.6(B2) U17.3(A2) U17.6(B2) U18.3(A2) U18.5(DIR) U18.6(B2) U19.3(A2) U19.6(B2)

### Notes on the sheet
- Buffer / Level
  Backplane --> Module
- Buffer / Level
  Backplane <-- Module
- Module Isolation

## Sheet 6 of 9
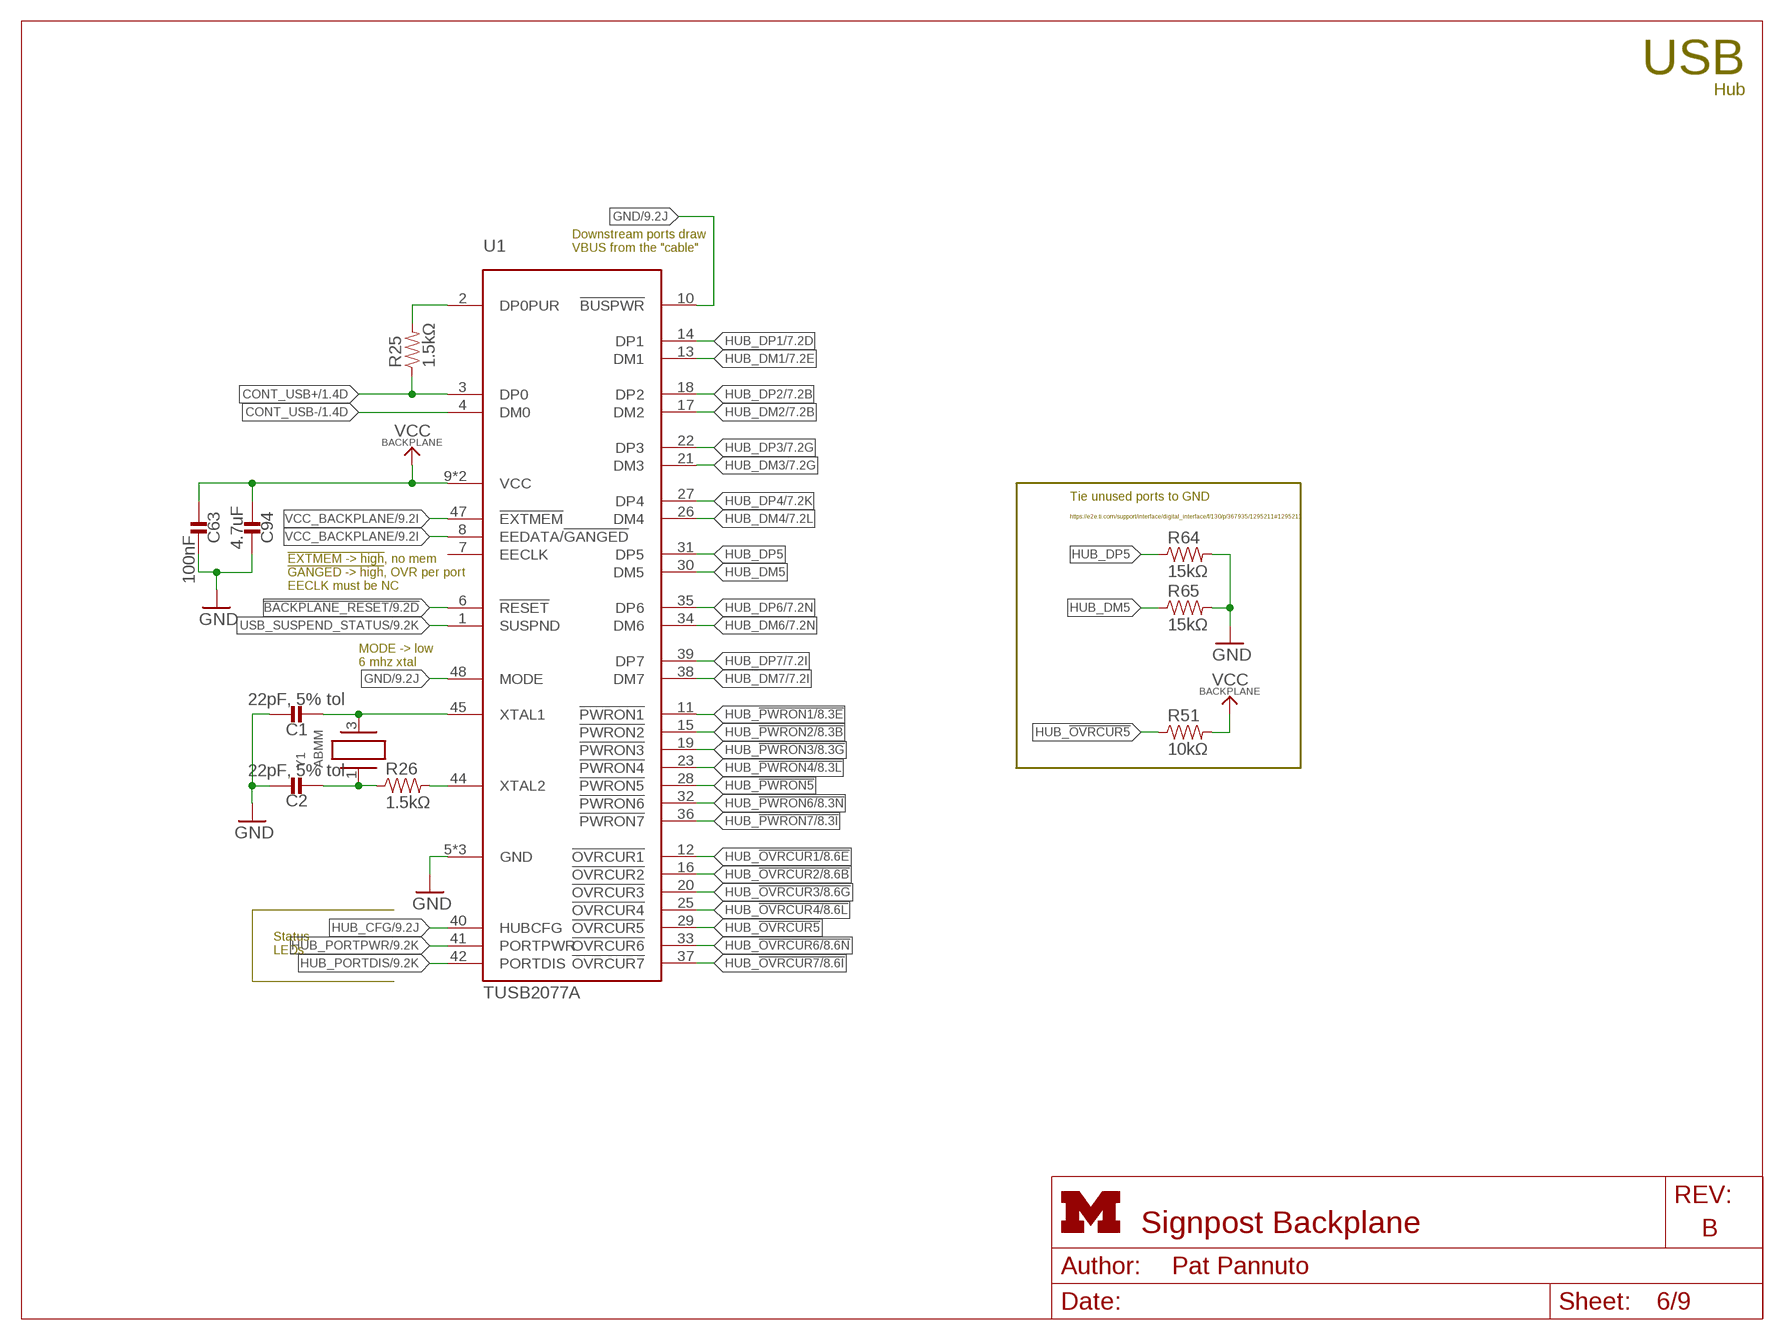
[diagram p5: schematic, sheet 6]
FRAME8 (LETTER_L_UMICH): HEIGHT: 8.5in; WIDTH: 11in

### Parts
C1  22pF, 5% tol  CAPACITOR0603_CAP  [0603_CAP]
C2  22pF, 5% tol  CAPACITOR0603_CAP  [0603_CAP]
C63  100nF  CAPACITOR0603_CAP  [0603_CAP]
C94  4.7uF  CAPACITOR0603_CAP  [0603_CAP]
R25  1.5kΩ  RESISTOR0603_RES  [0603-RES]
R26  1.5kΩ  RESISTOR0603_RES  [0603-RES]
R51  10kΩ  RESISTOR0603_RES  [0603-RES]
R64  15kΩ  RESISTOR0603_RES  [0603-RES]
R65  15kΩ  RESISTOR0603_RES  [0603-RES]
U1  TUSB2077A  [LQFP-48]
Y1  ABMM  [ABMM]

### Nets
!BACKPLANE_RESET: U1.6(!RESET) ; also sheet 1,3,9
CONT_USB+: R25.1 U1.3(DP0) ; also sheet 1
CONT_USB-: U1.4(DM0) ; also sheet 1
GND: C1.1 C2.1 C63.1 C94.1 R64.2 R65.2 U1.5(GND) U1.10(!BUSPWR) U1.24(GND) U1.43(GND) U1.48(MODE) ; also sheet 1,2,3,4,5,7,8,9
HUB_!OVRCUR1: U1.12(!OVRCUR1) ; also sheet 8,9
HUB_!OVRCUR2: U1.16(!OVRCUR2) ; also sheet 8,9
HUB_!OVRCUR3: U1.20(!OVRCUR3) ; also sheet 8,9
HUB_!OVRCUR4: U1.25(!OVRCUR4) ; also sheet 8,9
HUB_!OVRCUR5: R51.1 U1.29(!OVRCUR5)
HUB_!OVRCUR6: U1.33(!OVRCUR6) ; also sheet 8,9
HUB_!OVRCUR7: U1.37(!OVRCUR7) ; also sheet 8,9
HUB_!PWRON1: U1.11(!PWRON1) ; also sheet 8,9
HUB_!PWRON2: U1.15(!PWRON2) ; also sheet 8,9
HUB_!PWRON3: U1.19(!PWRON3) ; also sheet 8,9
HUB_!PWRON4: U1.23(!PWRON4) ; also sheet 8,9
HUB_!PWRON5: U1.28(!PWRON5)
HUB_!PWRON6: U1.32(!PWRON6) ; also sheet 8,9
HUB_!PWRON7: U1.36(!PWRON7) ; also sheet 8,9
HUB_CFG: U1.40(HUBCFG) ; also sheet 9
HUB_DM1: U1.13(DM1) ; also sheet 7
HUB_DM2: U1.17(DM2) ; also sheet 7
HUB_DM3: U1.21(DM3) ; also sheet 7
HUB_DM4: U1.26(DM4) ; also sheet 7
HUB_DM5: R65.1 U1.30(DM5)
HUB_DM6: U1.34(DM6) ; also sheet 7
HUB_DM7: U1.38(DM7) ; also sheet 7
HUB_DP1: U1.14(DP1) ; also sheet 7
HUB_DP2: U1.18(DP2) ; also sheet 7
HUB_DP3: U1.22(DP3) ; also sheet 7
HUB_DP4: U1.27(DP4) ; also sheet 7
HUB_DP5: R64.1 U1.31(DP5)
HUB_DP6: U1.35(DP6) ; also sheet 7
HUB_DP7: U1.39(DP7) ; also sheet 7
HUB_PORTDIS: U1.42(PORTDIS) ; also sheet 9
HUB_PORTPWR: U1.41(PORTPWR) ; also sheet 9
N$12: R25.2 U1.2(DP0PUR)
N$14: C2.2 R26.1 Y1.1
N$73: C1.2 U1.45(XTAL1) Y1.3
N$74: R26.2 U1.44(XTAL2)
USB_SUSPEND_STATUS: U1.1(SUSPND) ; also sheet 9
VCC_BACKPLANE: C63.2 C94.2 R51.2 U1.8(EEDATA/!GANGED) U1.9(VCC) U1.46(VCC) U1.47(!EXTMEM) ; also sheet 1,3,4,5,7,8,9
Unconnected: U1.7(EECLK)

### Notes on the sheet
- USB
- Hub
- Downstream ports draw
  VBUS from the "cable"
- Tie unused ports to GND
- https://e2e.ti.com/support/interface/digital_interface/f/130/p/367935/1295211#1295211
- !EXTMEM -> high, no mem
  !GANGED -> high, OVR per port
  EECLK must be NC
- MODE -> low
  6 mhz xtal
- Status
  LEDs

## Sheet 7 of 9
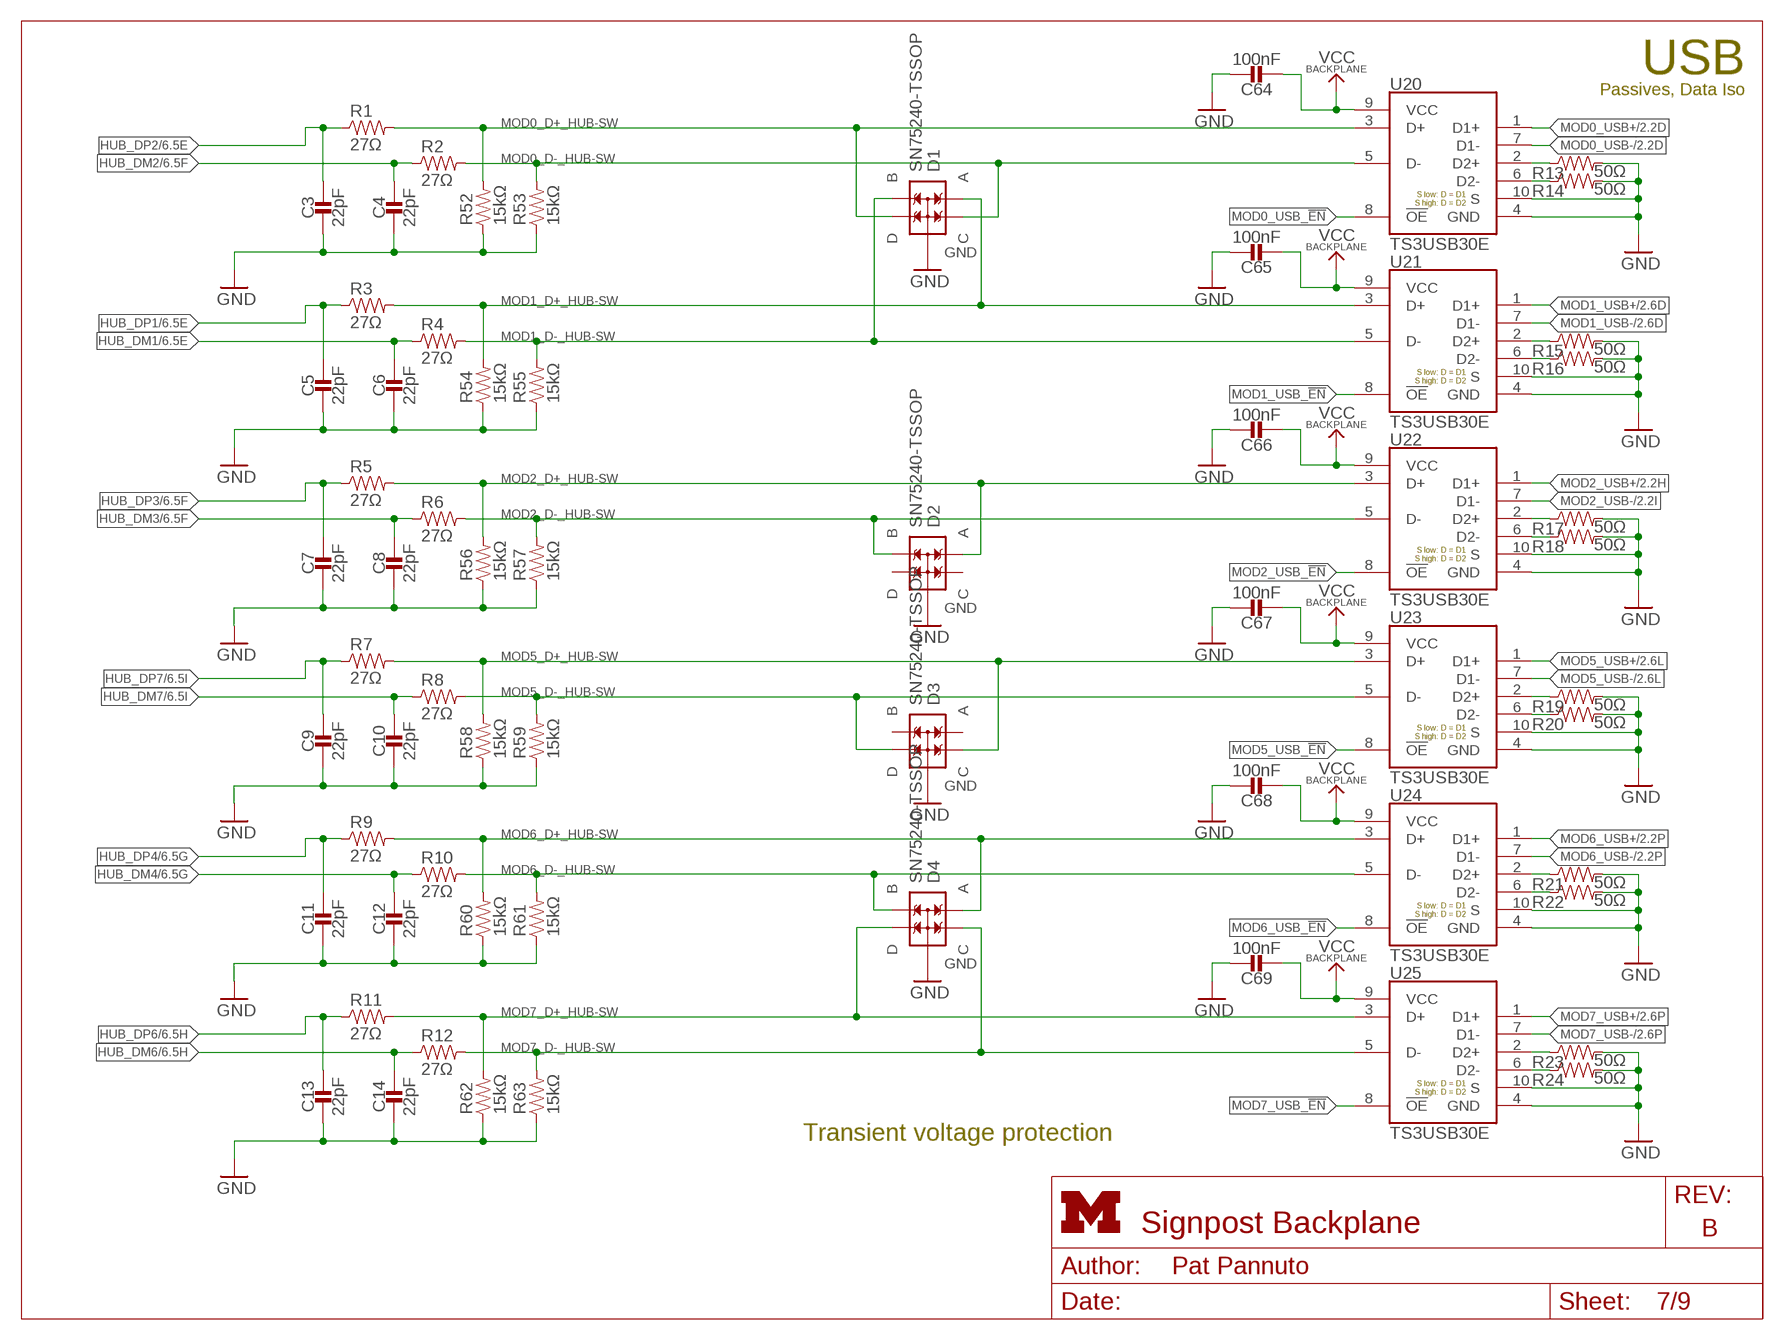
[diagram p6: schematic, sheet 7]
FRAME3 (LETTER_L): HEIGHT: 8.5in; WIDTH: 11in

### Parts
C3  22pF  CAPACITOR0402_CAP  [0402_CAP]
C4  22pF  CAPACITOR0402_CAP  [0402_CAP]
C5  22pF  CAPACITOR0402_CAP  [0402_CAP]
C6  22pF  CAPACITOR0402_CAP  [0402_CAP]
C7  22pF  CAPACITOR0402_CAP  [0402_CAP]
C8  22pF  CAPACITOR0402_CAP  [0402_CAP]
C9  22pF  CAPACITOR0402_CAP  [0402_CAP]
C10  22pF  CAPACITOR0402_CAP  [0402_CAP]
C11  22pF  CAPACITOR0402_CAP  [0402_CAP]
C12  22pF  CAPACITOR0402_CAP  [0402_CAP]
C13  22pF  CAPACITOR0402_CAP  [0402_CAP]
C14  22pF  CAPACITOR0402_CAP  [0402_CAP]
C64  100nF  CAPACITOR0603_CAP  [0603_CAP]
C65  100nF  CAPACITOR0603_CAP  [0603_CAP]
C66  100nF  CAPACITOR0603_CAP  [0603_CAP]
C67  100nF  CAPACITOR0603_CAP  [0603_CAP]
C68  100nF  CAPACITOR0603_CAP  [0603_CAP]
C69  100nF  CAPACITOR0603_CAP  [0603_CAP]
D1  SN75240-TSSOP  [TSSOP-8]
D2  SN75240-TSSOP  [TSSOP-8]
D3  SN75240-TSSOP  [TSSOP-8]
D4  SN75240-TSSOP  [TSSOP-8]
R1  27Ω  RESISTOR0402_RES-HIGH_SPEED  [0402_RES-HIGH_SPEED]
R2  27Ω  RESISTOR0402_RES-HIGH_SPEED  [0402_RES-HIGH_SPEED]
R3  27Ω  RESISTOR0402_RES-HIGH_SPEED  [0402_RES-HIGH_SPEED]
R4  27Ω  RESISTOR0402_RES-HIGH_SPEED  [0402_RES-HIGH_SPEED]
R5  27Ω  RESISTOR0402_RES-HIGH_SPEED  [0402_RES-HIGH_SPEED]
R6  27Ω  RESISTOR0402_RES-HIGH_SPEED  [0402_RES-HIGH_SPEED]
R7  27Ω  RESISTOR0402_RES-HIGH_SPEED  [0402_RES-HIGH_SPEED]
R8  27Ω  RESISTOR0402_RES-HIGH_SPEED  [0402_RES-HIGH_SPEED]
R9  27Ω  RESISTOR0402_RES-HIGH_SPEED  [0402_RES-HIGH_SPEED]
R10  27Ω  RESISTOR0402_RES-HIGH_SPEED  [0402_RES-HIGH_SPEED]
R11  27Ω  RESISTOR0402_RES-HIGH_SPEED  [0402_RES-HIGH_SPEED]
R12  27Ω  RESISTOR0402_RES-HIGH_SPEED  [0402_RES-HIGH_SPEED]
R13  50Ω  RESISTOR0603_RES  [0603-RES]
R14  50Ω  RESISTOR0603_RES  [0603-RES]
R15  50Ω  RESISTOR0603_RES  [0603-RES]
R16  50Ω  RESISTOR0603_RES  [0603-RES]
R17  50Ω  RESISTOR0603_RES  [0603-RES]
R18  50Ω  RESISTOR0603_RES  [0603-RES]
R19  50Ω  RESISTOR0603_RES  [0603-RES]
R20  50Ω  RESISTOR0603_RES  [0603-RES]
R21  50Ω  RESISTOR0603_RES  [0603-RES]
R22  50Ω  RESISTOR0603_RES  [0603-RES]
R23  50Ω  RESISTOR0603_RES  [0603-RES]
R24  50Ω  RESISTOR0603_RES  [0603-RES]
R52  15kΩ  RESISTOR0603_RES  [0603-RES]
R53  15kΩ  RESISTOR0603_RES  [0603-RES]
R54  15kΩ  RESISTOR0603_RES  [0603-RES]
R55  15kΩ  RESISTOR0603_RES  [0603-RES]
R56  15kΩ  RESISTOR0603_RES  [0603-RES]
R57  15kΩ  RESISTOR0603_RES  [0603-RES]
R58  15kΩ  RESISTOR0603_RES  [0603-RES]
R59  15kΩ  RESISTOR0603_RES  [0603-RES]
R60  15kΩ  RESISTOR0603_RES  [0603-RES]
R61  15kΩ  RESISTOR0603_RES  [0603-RES]
R62  15kΩ  RESISTOR0603_RES  [0603-RES]
R63  15kΩ  RESISTOR0603_RES  [0603-RES]
U20  TS3USB30E  [UQFN-10]
U21  TS3USB30E  [UQFN-10]
U22  TS3USB30E  [UQFN-10]
U23  TS3USB30E  [UQFN-10]
U24  TS3USB30E  [UQFN-10]
U25  TS3USB30E  [UQFN-10]

### Nets
GND: C3.2 C4.2 C5.2 C6.2 C7.2 C8.2 C9.2 C10.2 C11.2 C12.2 C13.2 C14.2 C64.1 C65.1 C66.1 C67.1 C68.1 C69.1 D1.1(GND) D1.3(GND) D1.5(GND) D1.7(GND) D2.1(GND) D2.3(GND) D2.5(GND) D2.7(GND) D3.1(GND) D3.3(GND) D3.5(GND) D3.7(GND) D4.1(GND) D4.3(GND) D4.5(GND) D4.7(GND) R13.2 R14.2 R15.2 R16.2 R17.2 R18.2 R19.2 R20.2 R21.2 R22.2 R23.2 R24.2 R52.1 R53.1 R54.1 R55.1 R56.1 R57.1 R58.1 R59.1 R60.1 R61.1 R62.1 R63.1 U20.4(GND) U20.10(S) U21.4(GND) U21.10(S) U22.4(GND) U22.10(S) U23.4(GND) U23.10(S) U24.4(GND) U24.10(S) U25.4(GND) U25.10(S) ; also sheet 1,2,3,4,5,6,8,9
HUB_DM1: C6.1 R4.1 ; also sheet 6
HUB_DM2: C4.1 R2.1 ; also sheet 6
HUB_DM3: C8.1 R6.1 ; also sheet 6
HUB_DM4: C12.1 R10.1 ; also sheet 6
HUB_DM6: C14.1 R12.1 ; also sheet 6
HUB_DM7: C10.1 R8.1 ; also sheet 6
HUB_DP1: C5.1 R3.1 ; also sheet 6
HUB_DP2: C3.1 R1.1 ; also sheet 6
HUB_DP3: C7.1 R5.1 ; also sheet 6
HUB_DP4: C11.1 R9.1 ; also sheet 6
HUB_DP6: C13.1 R11.1 ; also sheet 6
HUB_DP7: C9.1 R7.1 ; also sheet 6
MOD0_D+_HUB-SW: D1.4(D) R1.2 R52.2 U20.3(D+)
MOD0_D-_HUB-SW: D1.2(C) R2.2 R53.2 U20.5(D-)
MOD0_USB+: U20.1(D1+) ; also sheet 2
MOD0_USB-: U20.7(D1-) ; also sheet 2
MOD0_USB_!EN: U20.8(!OE) ; also sheet 8
MOD1_D+_HUB-SW: D1.8(A) R3.2 R54.2 U21.3(D+)
MOD1_D-_HUB-SW: D1.6(B) R4.2 R55.2 U21.5(D-)
MOD1_USB+: U21.1(D1+) ; also sheet 2
MOD1_USB-: U21.7(D1-) ; also sheet 2
MOD1_USB_!EN: U21.8(!OE) ; also sheet 8
MOD2_D+_HUB-SW: D2.8(A) R5.2 R56.2 U22.3(D+)
MOD2_D-_HUB-SW: D2.6(B) R6.2 R57.2 U22.5(D-)
MOD2_USB+: U22.1(D1+) ; also sheet 2
MOD2_USB-: U22.7(D1-) ; also sheet 2
MOD2_USB_!EN: U22.8(!OE) ; also sheet 8
MOD5_D+_HUB-SW: D3.2(C) R7.2 R58.2 U23.3(D+)
MOD5_D-_HUB-SW: D3.4(D) R8.2 R59.2 U23.5(D-)
MOD5_USB+: U23.1(D1+) ; also sheet 2
MOD5_USB-: U23.7(D1-) ; also sheet 2
MOD5_USB_!EN: U23.8(!OE) ; also sheet 8
MOD6_D+_HUB-SW: D4.8(A) R9.2 R60.2 U24.3(D+)
MOD6_D-_HUB-SW: D4.6(B) R10.2 R61.2 U24.5(D-)
MOD6_USB+: U24.1(D1+) ; also sheet 2
MOD6_USB-: U24.7(D1-) ; also sheet 2
MOD6_USB_!EN: U24.8(!OE) ; also sheet 8
MOD7_D+_HUB-SW: D4.4(D) R11.2 R62.2 U25.3(D+)
MOD7_D-_HUB-SW: D4.2(C) R12.2 R63.2 U25.5(D-)
MOD7_USB+: U25.1(D1+) ; also sheet 2
MOD7_USB-: U25.7(D1-) ; also sheet 2
MOD7_USB_!EN: U25.8(!OE) ; also sheet 8
N$17: R13.1 U20.2(D2+)
N$18: R24.1 U25.6(D2-)
N$19: R23.1 U25.2(D2+)
N$20: R22.1 U24.6(D2-)
N$21: R21.1 U24.2(D2+)
N$22: R20.1 U23.6(D2-)
N$23: R19.1 U23.2(D2+)
N$24: R17.1 U22.2(D2+)
N$25: R18.1 U22.6(D2-)
N$26: R16.1 U21.6(D2-)
N$27: R15.1 U21.2(D2+)
N$31: R14.1 U20.6(D2-)
VCC_BACKPLANE: C64.2 C65.2 C66.2 C67.2 C68.2 C69.2 U20.9(VCC) U21.9(VCC) U22.9(VCC) U23.9(VCC) U24.9(VCC) U25.9(VCC) ; also sheet 1,3,4,5,6,8,9
Unconnected: D2.2(C) D2.4(D) D3.6(B) D3.8(A)

### Notes on the sheet
- USB
- Passives, Data Iso
- Transient voltage protection

## Sheet 8 of 9
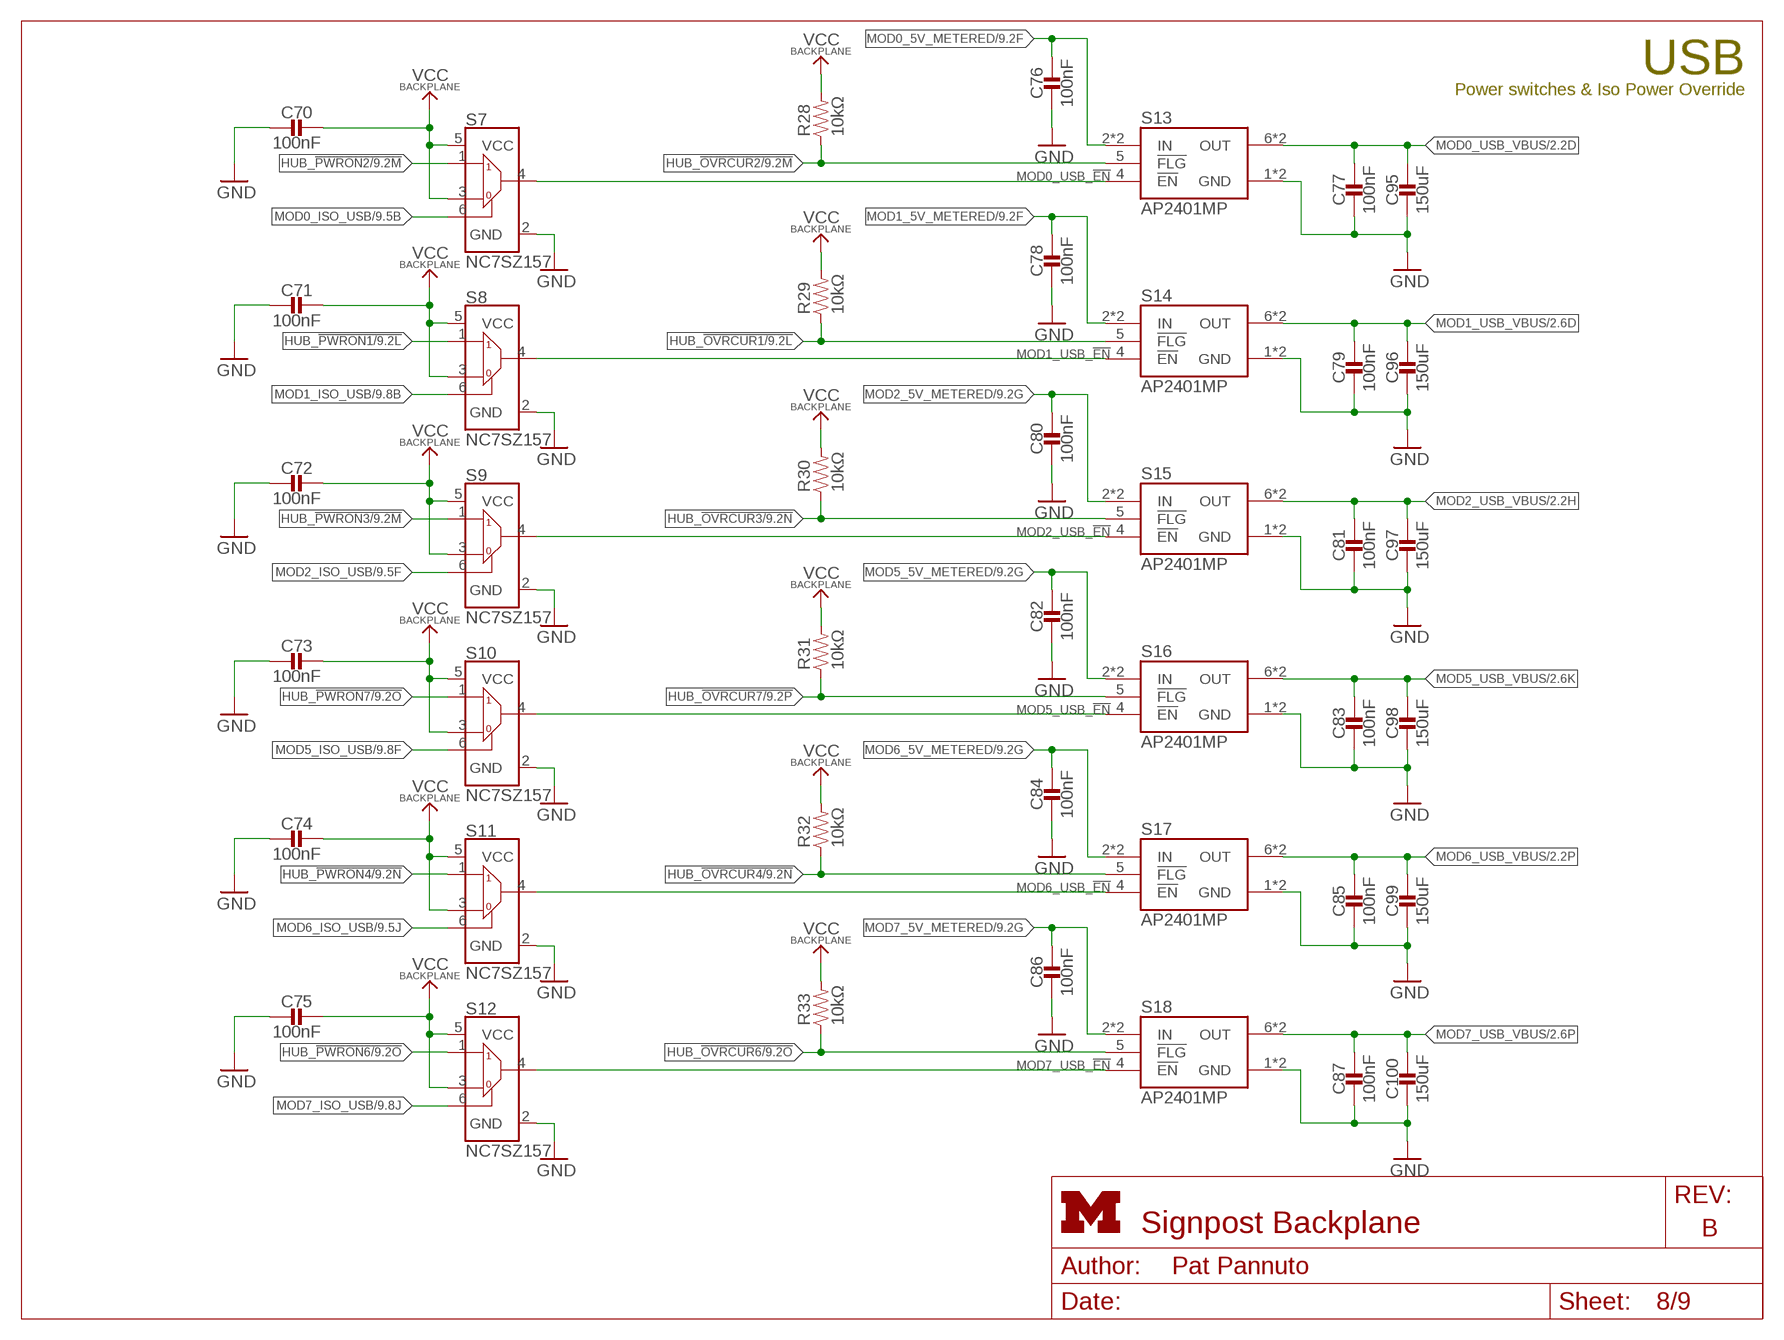
[diagram p7: schematic, sheet 8]
FRAME6 (LETTER_L_UMICH): HEIGHT: 8.5in; WIDTH: 11in

### Parts
C70  100nF  CAPACITOR0603_CAP  [0603_CAP]
C71  100nF  CAPACITOR0603_CAP  [0603_CAP]
C72  100nF  CAPACITOR0603_CAP  [0603_CAP]
C73  100nF  CAPACITOR0603_CAP  [0603_CAP]
C74  100nF  CAPACITOR0603_CAP  [0603_CAP]
C75  100nF  CAPACITOR0603_CAP  [0603_CAP]
C76  100nF  CAPACITOR0603_CAP  [0603_CAP]
C77  100nF  CAPACITOR0603_CAP  [0603_CAP]
C78  100nF  CAPACITOR0603_CAP  [0603_CAP]
C79  100nF  CAPACITOR0603_CAP  [0603_CAP]
C80  100nF  CAPACITOR0603_CAP  [0603_CAP]
C81  100nF  CAPACITOR0603_CAP  [0603_CAP]
C82  100nF  CAPACITOR0603_CAP  [0603_CAP]
C83  100nF  CAPACITOR0603_CAP  [0603_CAP]
C84  100nF  CAPACITOR0603_CAP  [0603_CAP]
C85  100nF  CAPACITOR0603_CAP  [0603_CAP]
C86  100nF  CAPACITOR0603_CAP  [0603_CAP]
C87  100nF  CAPACITOR0603_CAP  [0603_CAP]
C95  150uF  CAPACITOR1210_CAP  [1210_CAP]
C96  150uF  CAPACITOR1210_CAP  [1210_CAP]
C97  150uF  CAPACITOR1210_CAP  [1210_CAP]
C98  150uF  CAPACITOR1210_CAP  [1210_CAP]
C99  150uF  CAPACITOR1210_CAP  [1210_CAP]
C100  150uF  CAPACITOR1210_CAP  [1210_CAP]
R28  10kΩ  RESISTOR0603_RES  [0603-RES]
R29  10kΩ  RESISTOR0603_RES  [0603-RES]
R30  10kΩ  RESISTOR0603_RES  [0603-RES]
R31  10kΩ  RESISTOR0603_RES  [0603-RES]
R32  10kΩ  RESISTOR0603_RES  [0603-RES]
R33  10kΩ  RESISTOR0603_RES  [0603-RES]
S7  NC7SZ157  [SC70-6]
S8  NC7SZ157  [SC70-6]
S9  NC7SZ157  [SC70-6]
S10  NC7SZ157  [SC70-6]
S11  NC7SZ157  [SC70-6]
S12  NC7SZ157  [SC70-6]
S13  AP2401MP  [MSOP-8EP]
S14  AP2401MP  [MSOP-8EP]
S15  AP2401MP  [MSOP-8EP]
S16  AP2401MP  [MSOP-8EP]
S17  AP2401MP  [MSOP-8EP]
S18  AP2401MP  [MSOP-8EP]

### Nets
GND: C70.2 C71.2 C72.2 C73.2 C74.2 C75.2 C76.2 C77.2 C78.2 C79.2 C80.2 C81.2 C82.2 C83.2 C84.2 C85.2 C86.2 C87.2 C95.2 C96.2 C97.2 C98.2 C99.2 C100.2 S7.2(GND) S8.2(GND) S9.2(GND) S10.2(GND) S11.2(GND) S12.2(GND) S13.1(GND) S13.PAD(GND) S14.1(GND) S14.PAD(GND) S15.1(GND) S15.PAD(GND) S16.1(GND) S16.PAD(GND) S17.1(GND) S17.PAD(GND) S18.1(GND) S18.PAD(GND) ; also sheet 1,2,3,4,5,6,7,9
HUB_!OVRCUR1: R29.1 S14.5(!FLG) ; also sheet 6,9
HUB_!OVRCUR2: R28.1 S13.5(!FLG) ; also sheet 6,9
HUB_!OVRCUR3: R30.1 S15.5(!FLG) ; also sheet 6,9
HUB_!OVRCUR4: R32.1 S17.5(!FLG) ; also sheet 6,9
HUB_!OVRCUR6: R33.1 S18.5(!FLG) ; also sheet 6,9
HUB_!OVRCUR7: R31.1 S16.5(!FLG) ; also sheet 6,9
HUB_!PWRON1: S8.1(I1) ; also sheet 6,9
HUB_!PWRON2: S7.1(I1) ; also sheet 6,9
HUB_!PWRON3: S9.1(I1) ; also sheet 6,9
HUB_!PWRON4: S11.1(I1) ; also sheet 6,9
HUB_!PWRON6: S12.1(I1) ; also sheet 6,9
HUB_!PWRON7: S10.1(I1) ; also sheet 6,9
MOD0_5V_METERED: C76.1 S13.2(IN) S13.3(IN) ; also sheet 1,4,9
MOD0_ISO_USB: S7.6(S) ; also sheet 3,9
MOD0_USB_!EN: S7.4(Z) S13.4(!EN) ; also sheet 7
MOD0_USB_VBUS: C77.1 C95.1 S13.6(OUT) S13.7(OUT) ; also sheet 2
MOD1_5V_METERED: C78.1 S14.2(IN) S14.3(IN) ; also sheet 1,4,9
MOD1_ISO_USB: S8.6(S) ; also sheet 3,9
MOD1_USB_!EN: S8.4(Z) S14.4(!EN) ; also sheet 7
MOD1_USB_VBUS: C79.1 C96.1 S14.6(OUT) S14.7(OUT) ; also sheet 2
MOD2_5V_METERED: C80.1 S15.2(IN) S15.3(IN) ; also sheet 1,4,9
MOD2_ISO_USB: S9.6(S) ; also sheet 3,9
MOD2_USB_!EN: S9.4(Z) S15.4(!EN) ; also sheet 7
MOD2_USB_VBUS: C81.1 C97.1 S15.6(OUT) S15.7(OUT) ; also sheet 2
MOD5_5V_METERED: C82.1 S16.2(IN) S16.3(IN) ; also sheet 1,4,9
MOD5_ISO_USB: S10.6(S) ; also sheet 3,9
MOD5_USB_!EN: S10.4(Z) S16.4(!EN) ; also sheet 7
MOD5_USB_VBUS: C83.1 C98.1 S16.6(OUT) S16.7(OUT) ; also sheet 2
MOD6_5V_METERED: C84.1 S17.2(IN) S17.3(IN) ; also sheet 1,4,9
MOD6_ISO_USB: S11.6(S) ; also sheet 3,9
MOD6_USB_!EN: S11.4(Z) S17.4(!EN) ; also sheet 7
MOD6_USB_VBUS: C85.1 C99.1 S17.6(OUT) S17.7(OUT) ; also sheet 2
MOD7_5V_METERED: C86.1 S18.2(IN) S18.3(IN) ; also sheet 1,4,9
MOD7_ISO_USB: S12.6(S) ; also sheet 3,9
MOD7_USB_!EN: S12.4(Z) S18.4(!EN) ; also sheet 7
MOD7_USB_VBUS: C87.1 C100.1 S18.6(OUT) S18.7(OUT) ; also sheet 2
VCC_BACKPLANE: C70.1 C71.1 C72.1 C73.1 C74.1 C75.1 R28.2 R29.2 R30.2 R31.2 R32.2 R33.2 S7.3(I0) S7.5(VCC) S8.3(I0) S8.5(VCC) S9.3(I0) S9.5(VCC) S10.3(I0) S10.5(VCC) S11.3(I0) S11.5(VCC) S12.3(I0) S12.5(VCC) ; also sheet 1,3,4,5,6,7,9

### Notes on the sheet
- USB
- Power switches & Iso Power Override

## Sheet 9 of 9
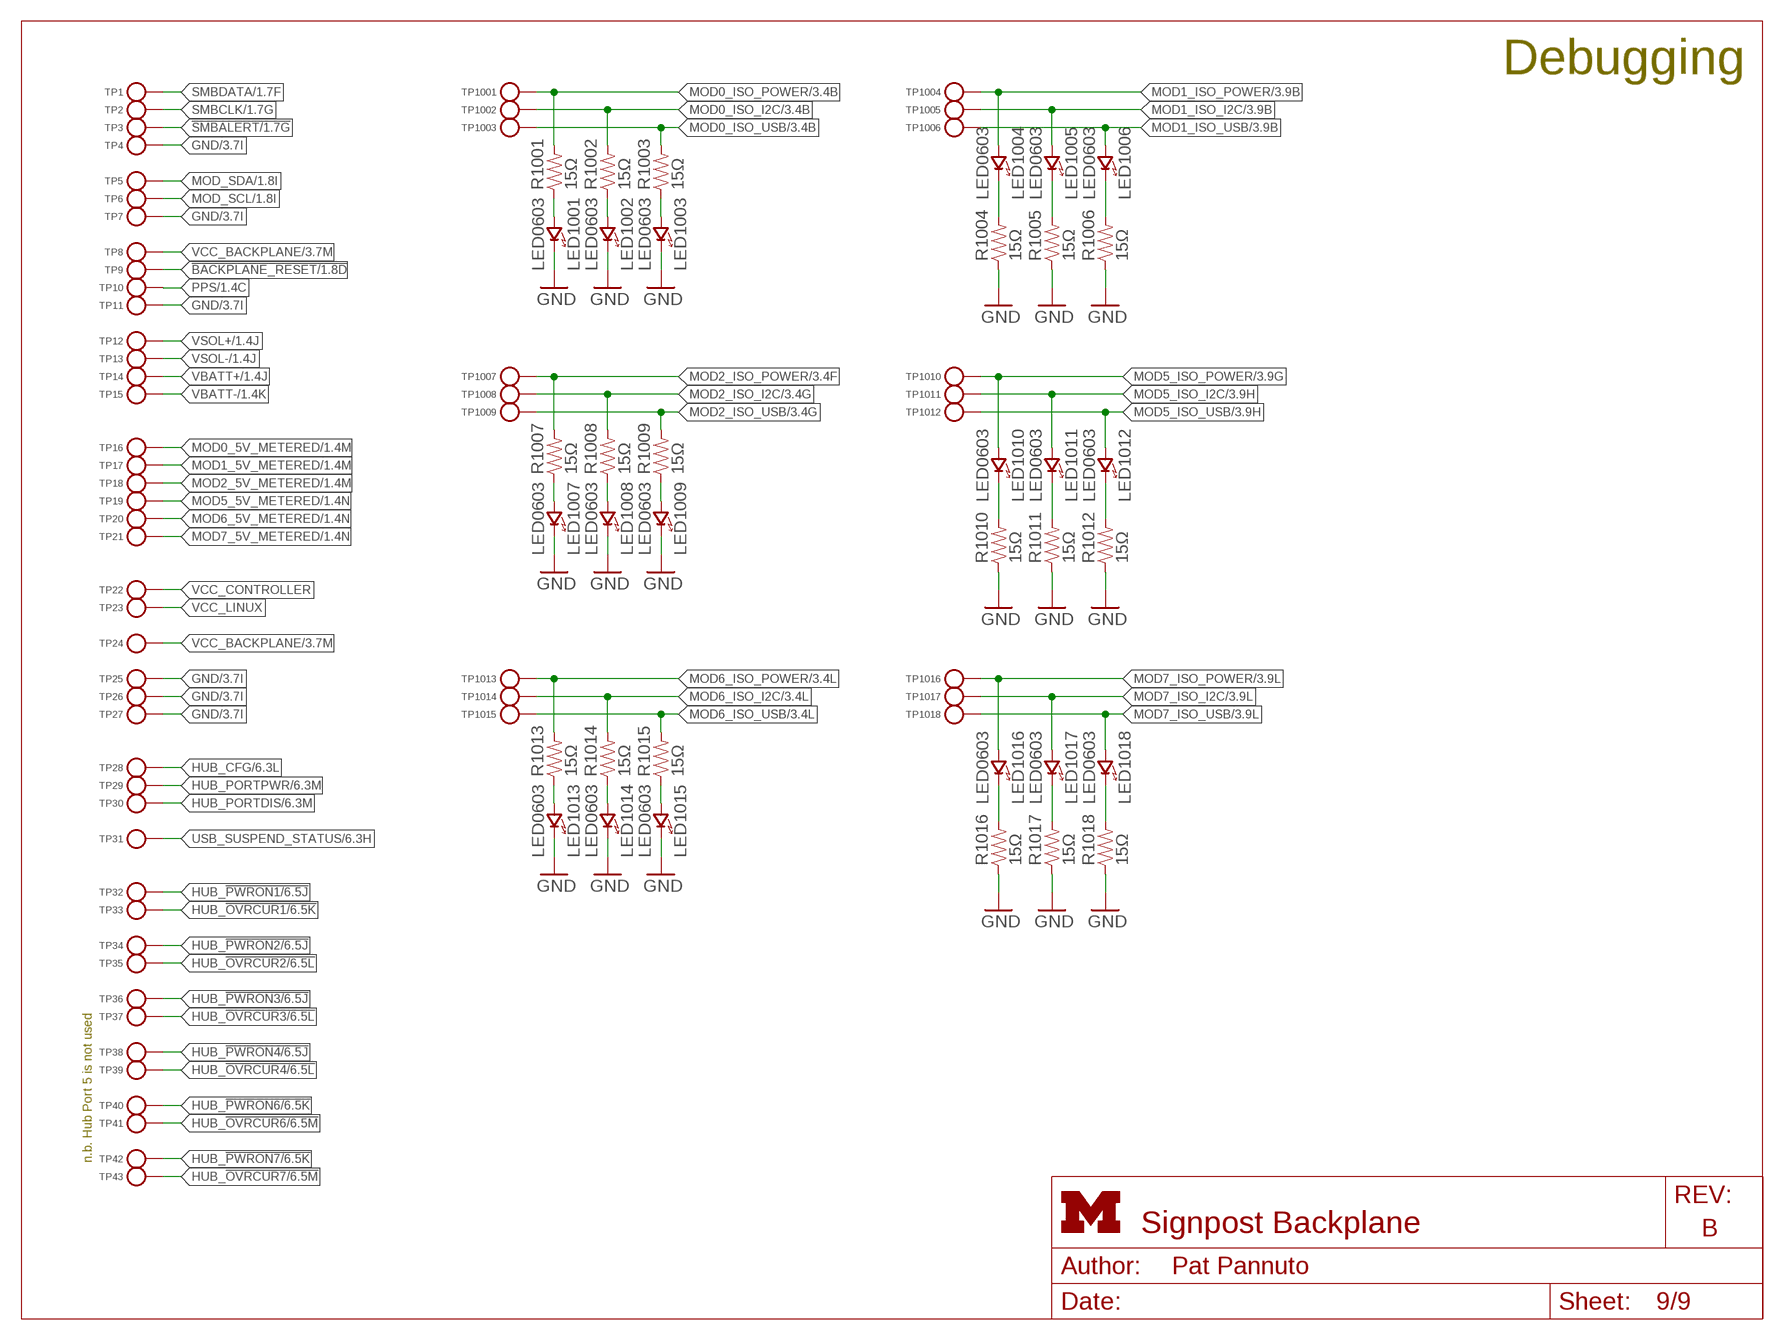
[diagram p8: schematic, sheet 9]
FRAME9 (LETTER_L_UMICH): HEIGHT: 8.5in; WIDTH: 11in

### Parts
LED1001  LED0603  [LED-0603]
LED1002  LED0603  [LED-0603]
LED1003  LED0603  [LED-0603]
LED1004  LED0603  [LED-0603]
LED1005  LED0603  [LED-0603]
LED1006  LED0603  [LED-0603]
LED1007  LED0603  [LED-0603]
LED1008  LED0603  [LED-0603]
LED1009  LED0603  [LED-0603]
LED1010  LED0603  [LED-0603]
LED1011  LED0603  [LED-0603]
LED1012  LED0603  [LED-0603]
LED1013  LED0603  [LED-0603]
LED1014  LED0603  [LED-0603]
LED1015  LED0603  [LED-0603]
LED1016  LED0603  [LED-0603]
LED1017  LED0603  [LED-0603]
LED1018  LED0603  [LED-0603]
R1001  15Ω  RESISTOR0603_RES  [0603-RES]
R1002  15Ω  RESISTOR0603_RES  [0603-RES]
R1003  15Ω  RESISTOR0603_RES  [0603-RES]
R1004  15Ω  RESISTOR0603_RES  [0603-RES]
R1005  15Ω  RESISTOR0603_RES  [0603-RES]
R1006  15Ω  RESISTOR0603_RES  [0603-RES]
R1007  15Ω  RESISTOR0603_RES  [0603-RES]
R1008  15Ω  RESISTOR0603_RES  [0603-RES]
R1009  15Ω  RESISTOR0603_RES  [0603-RES]
R1010  15Ω  RESISTOR0603_RES  [0603-RES]
R1011  15Ω  RESISTOR0603_RES  [0603-RES]
R1012  15Ω  RESISTOR0603_RES  [0603-RES]
R1013  15Ω  RESISTOR0603_RES  [0603-RES]
R1014  15Ω  RESISTOR0603_RES  [0603-RES]
R1015  15Ω  RESISTOR0603_RES  [0603-RES]
R1016  15Ω  RESISTOR0603_RES  [0603-RES]
R1017  15Ω  RESISTOR0603_RES  [0603-RES]
R1018  15Ω  RESISTOR0603_RES  [0603-RES]
TP1  TEST_POINT_0.040IN  [TESTPOINT_0.040IN]
TP2  TEST_POINT_0.040IN  [TESTPOINT_0.040IN]
TP3  TEST_POINT_0.040IN  [TESTPOINT_0.040IN]
TP4  TEST_POINT_0.040IN  [TESTPOINT_0.040IN]
TP5  TEST_POINT_0.040IN  [TESTPOINT_0.040IN]
TP6  TEST_POINT_0.040IN  [TESTPOINT_0.040IN]
TP7  TEST_POINT_0.040IN  [TESTPOINT_0.040IN]
TP8  TEST_POINT_0.040IN  [TESTPOINT_0.040IN]
TP9  TEST_POINT_0.040IN  [TESTPOINT_0.040IN]
TP10  TEST_POINT_0.040IN  [TESTPOINT_0.040IN]
TP11  TEST_POINT_0.040IN  [TESTPOINT_0.040IN]
TP12  TEST_POINT_0.040IN  [TESTPOINT_0.040IN]
TP13  TEST_POINT_0.040IN  [TESTPOINT_0.040IN]
TP14  TEST_POINT_0.040IN  [TESTPOINT_0.040IN]
TP15  TEST_POINT_0.040IN  [TESTPOINT_0.040IN]
TP16  TEST_POINT_0.040IN  [TESTPOINT_0.040IN]
TP17  TEST_POINT_0.040IN  [TESTPOINT_0.040IN]
TP18  TEST_POINT_0.040IN  [TESTPOINT_0.040IN]
TP19  TEST_POINT_0.040IN  [TESTPOINT_0.040IN]
TP20  TEST_POINT_0.040IN  [TESTPOINT_0.040IN]
TP21  TEST_POINT_0.040IN  [TESTPOINT_0.040IN]
TP22  TEST_POINT_0.040IN  [TESTPOINT_0.040IN]
TP23  TEST_POINT_0.040IN  [TESTPOINT_0.040IN]
TP24  TEST_POINT_0.040IN  [TESTPOINT_0.040IN]
TP25  TEST_POINT_0.040IN  [TESTPOINT_0.040IN]
TP26  TEST_POINT_0.040IN  [TESTPOINT_0.040IN]
TP27  TEST_POINT_0.040IN  [TESTPOINT_0.040IN]
TP28  TEST_POINT_0.040IN  [TESTPOINT_0.040IN]
TP29  TEST_POINT_0.040IN  [TESTPOINT_0.040IN]
TP30  TEST_POINT_0.040IN  [TESTPOINT_0.040IN]
TP31  TEST_POINT_0.040IN  [TESTPOINT_0.040IN]
TP32  TEST_POINT_0.040IN  [TESTPOINT_0.040IN]
TP33  TEST_POINT_0.040IN  [TESTPOINT_0.040IN]
TP34  TEST_POINT_0.040IN  [TESTPOINT_0.040IN]
TP35  TEST_POINT_0.040IN  [TESTPOINT_0.040IN]
TP36  TEST_POINT_0.040IN  [TESTPOINT_0.040IN]
TP37  TEST_POINT_0.040IN  [TESTPOINT_0.040IN]
TP38  TEST_POINT_0.040IN  [TESTPOINT_0.040IN]
TP39  TEST_POINT_0.040IN  [TESTPOINT_0.040IN]
TP40  TEST_POINT_0.040IN  [TESTPOINT_0.040IN]
TP41  TEST_POINT_0.040IN  [TESTPOINT_0.040IN]
TP42  TEST_POINT_0.040IN  [TESTPOINT_0.040IN]
TP43  TEST_POINT_0.040IN  [TESTPOINT_0.040IN]
TP1001  TEST_POINT_0.040IN  [TESTPOINT_0.040IN]
TP1002  TEST_POINT_0.040IN  [TESTPOINT_0.040IN]
TP1003  TEST_POINT_0.040IN  [TESTPOINT_0.040IN]
TP1004  TEST_POINT_0.040IN  [TESTPOINT_0.040IN]
TP1005  TEST_POINT_0.040IN  [TESTPOINT_0.040IN]
TP1006  TEST_POINT_0.040IN  [TESTPOINT_0.040IN]
TP1007  TEST_POINT_0.040IN  [TESTPOINT_0.040IN]
TP1008  TEST_POINT_0.040IN  [TESTPOINT_0.040IN]
TP1009  TEST_POINT_0.040IN  [TESTPOINT_0.040IN]
TP1010  TEST_POINT_0.040IN  [TESTPOINT_0.040IN]
TP1011  TEST_POINT_0.040IN  [TESTPOINT_0.040IN]
TP1012  TEST_POINT_0.040IN  [TESTPOINT_0.040IN]
TP1013  TEST_POINT_0.040IN  [TESTPOINT_0.040IN]
TP1014  TEST_POINT_0.040IN  [TESTPOINT_0.040IN]
TP1015  TEST_POINT_0.040IN  [TESTPOINT_0.040IN]
TP1016  TEST_POINT_0.040IN  [TESTPOINT_0.040IN]
TP1017  TEST_POINT_0.040IN  [TESTPOINT_0.040IN]
TP1018  TEST_POINT_0.040IN  [TESTPOINT_0.040IN]

### Nets
!BACKPLANE_RESET: TP9.TESTPOINT ; also sheet 1,3,6
!SMBALERT: TP3.TESTPOINT ; also sheet 1
GND: LED1001.C(CATHODE) LED1002.C(CATHODE) LED1003.C(CATHODE) LED1007.C(CATHODE) LED1008.C(CATHODE) LED1009.C(CATHODE) LED1013.C(CATHODE) LED1014.C(CATHODE) LED1015.C(CATHODE) R1004.1 R1005.1 R1006.1 R1010.1 R1011.1 R1012.1 R1016.1 R1017.1 R1018.1 TP4.TESTPOINT TP7.TESTPOINT TP11.TESTPOINT TP25.TESTPOINT TP26.TESTPOINT TP27.TESTPOINT ; also sheet 1,2,3,4,5,6,7,8
HUB_!OVRCUR1: TP33.TESTPOINT ; also sheet 6,8
HUB_!OVRCUR2: TP35.TESTPOINT ; also sheet 6,8
HUB_!OVRCUR3: TP37.TESTPOINT ; also sheet 6,8
HUB_!OVRCUR4: TP39.TESTPOINT ; also sheet 6,8
HUB_!OVRCUR6: TP41.TESTPOINT ; also sheet 6,8
HUB_!OVRCUR7: TP43.TESTPOINT ; also sheet 6,8
HUB_!PWRON1: TP32.TESTPOINT ; also sheet 6,8
HUB_!PWRON2: TP34.TESTPOINT ; also sheet 6,8
HUB_!PWRON3: TP36.TESTPOINT ; also sheet 6,8
HUB_!PWRON4: TP38.TESTPOINT ; also sheet 6,8
HUB_!PWRON6: TP40.TESTPOINT ; also sheet 6,8
HUB_!PWRON7: TP42.TESTPOINT ; also sheet 6,8
HUB_CFG: TP28.TESTPOINT ; also sheet 6
HUB_PORTDIS: TP30.TESTPOINT ; also sheet 6
HUB_PORTPWR: TP29.TESTPOINT ; also sheet 6
MOD0_5V_METERED: TP16.TESTPOINT ; also sheet 1,4,8
MOD0_ISO_I2C: R1002.2 TP1002.TESTPOINT ; also sheet 3,4
MOD0_ISO_POWER: R1001.2 TP1001.TESTPOINT ; also sheet 3,4
MOD0_ISO_USB: R1003.2 TP1003.TESTPOINT ; also sheet 3,8
MOD1_5V_METERED: TP17.TESTPOINT ; also sheet 1,4,8
MOD1_ISO_I2C: LED1005.A(ANODE) TP1005.TESTPOINT ; also sheet 3,4
MOD1_ISO_POWER: LED1004.A(ANODE) TP1004.TESTPOINT ; also sheet 3,4
MOD1_ISO_USB: LED1006.A(ANODE) TP1006.TESTPOINT ; also sheet 3,8
MOD2_5V_METERED: TP18.TESTPOINT ; also sheet 1,4,8
MOD2_ISO_I2C: R1008.2 TP1008.TESTPOINT ; also sheet 3,4
MOD2_ISO_POWER: R1007.2 TP1007.TESTPOINT ; also sheet 3,4
MOD2_ISO_USB: R1009.2 TP1009.TESTPOINT ; also sheet 3,8
MOD5_5V_METERED: TP19.TESTPOINT ; also sheet 1,4,8
MOD5_ISO_I2C: LED1011.A(ANODE) TP1011.TESTPOINT ; also sheet 3,4
MOD5_ISO_POWER: LED1010.A(ANODE) TP1010.TESTPOINT ; also sheet 3,4
MOD5_ISO_USB: LED1012.A(ANODE) TP1012.TESTPOINT ; also sheet 3,8
MOD6_5V_METERED: TP20.TESTPOINT ; also sheet 1,4,8
MOD6_ISO_I2C: R1014.2 TP1014.TESTPOINT ; also sheet 3,4
MOD6_ISO_POWER: R1013.2 TP1013.TESTPOINT ; also sheet 3,4
MOD6_ISO_USB: R1015.2 TP1015.TESTPOINT ; also sheet 3,8
MOD7_5V_METERED: TP21.TESTPOINT ; also sheet 1,4,8
MOD7_ISO_I2C: LED1017.A(ANODE) TP1017.TESTPOINT ; also sheet 3,4
MOD7_ISO_POWER: LED1016.A(ANODE) TP1016.TESTPOINT ; also sheet 3,4
MOD7_ISO_USB: LED1018.A(ANODE) TP1018.TESTPOINT ; also sheet 3,8
MOD_SCL: TP6.TESTPOINT ; also sheet 1,4
MOD_SDA: TP5.TESTPOINT ; also sheet 1,4
N$1: LED1001.A(ANODE) R1001.1
N$2: LED1002.A(ANODE) R1002.1
N$3: LED1003.A(ANODE) R1003.1
N$4: LED1007.A(ANODE) R1007.1
N$5: LED1008.A(ANODE) R1008.1
N$6: LED1009.A(ANODE) R1009.1
N$7: LED1013.A(ANODE) R1013.1
N$8: LED1014.A(ANODE) R1014.1
N$9: LED1015.A(ANODE) R1015.1
N$10: LED1004.C(CATHODE) R1004.2
N$11: LED1005.C(CATHODE) R1005.2
N$13: LED1006.C(CATHODE) R1006.2
N$15: LED1010.C(CATHODE) R1010.2
N$16: LED1011.C(CATHODE) R1011.2
N$28: LED1012.C(CATHODE) R1012.2
N$29: LED1016.C(CATHODE) R1016.2
N$30: LED1017.C(CATHODE) R1017.2
N$32: LED1018.C(CATHODE) R1018.2
PPS: TP10.TESTPOINT ; also sheet 1,5
SMBCLK: TP2.TESTPOINT ; also sheet 1,3
SMBDATA: TP1.TESTPOINT ; also sheet 1,3
USB_SUSPEND_STATUS: TP31.TESTPOINT ; also sheet 6
VBATT+: TP14.TESTPOINT ; also sheet 1
VBATT-: TP15.TESTPOINT ; also sheet 1
VCC_BACKPLANE: TP8.TESTPOINT TP24.TESTPOINT ; also sheet 1,3,4,5,6,7,8
VCC_CONTROLLER: TP22.TESTPOINT ; also sheet 1
VCC_LINUX: TP23.TESTPOINT ; also sheet 1
VSOL+: TP12.TESTPOINT ; also sheet 1
VSOL-: TP13.TESTPOINT ; also sheet 1

### Notes on the sheet
- Debugging
- n.b. Hub Port 5 is not used

## Library data of the parts
C1 C2 = passives:CAPACITOR: 0402 Capacitor; DIGIKEY: 1276-1023-1-ND
C3-C94 = passives:CAPACITOR: 0402 Capacitor
C95-C100 = passives:CAPACITOR: 0402 Capacitor; DIGIKEY: 1276-3367-1-ND
D1-D4 = signpost:SN75240-TSSOP: TVS Diodes [suggested for TI USB Hub] (2 array); DIGIKEY: 296-6596-1-ND
J0 J1 J2 J5-J7 = signpost:BACKPLANE_GENERIC_MODULE: Signpost generic module recepticle; DIGIKEY: S9195-ND
J3 = signpost:BACKPLANE_CONTROLLER_MODULE: Signpost controller recepticle; DIGIKEY: S9197-ND , S9194-ND
J4 = signpost:BACKPLANE_POWER_MODULE: Signpost power module recepticle; DIGIKEY: S9197-ND
LED1001-LED1018 = leds:LED: LED
LOGO1-LOGO9 = logos:UMICH_SOLID
R1-R83 R1001-R1018 = passives:RESISTOR: Resistor Basic schematic elements and footprints for 0603, 1206, and PTH resistors.
S1-S6 = signpost:SIP3240X: High power (2.4 A) high-side switch; DIGIKEY: SIP32402ADNP-T1GE4CT-ND
S7-S12 = signpost:NC7SZ157: MUX; DIGIKEY: NC7SZ157P6XCT-ND
S13-S18 = signpost:AP2401MP: USB Power Switch; DIGIKEY: AP2401MP-13DICT-ND
TP1-TP43 TP1001-TP1018 = headers:TEST_POINT_0.040IN: 0.040in Test Point; DIGIKEY: 5001K-ND
U1 = signpost:TUSB2077A: Full Speed USB Hub - 7 Port; DIGIKEY: 296-37871-1-ND
U2-U7 = signpost:FXMA2102: Dual Supply, 2-Bit Voltage Translator / Buffer / Repeater / Isolator for I2C; DIGIKEY: FXMA2102UMXCT-ND
U8-U19 = signpost:SN74LVC2T45: Bidirectional Buffer / Level Converter 2 Circuits; DIGIKEY: 296-17014-1-ND
U20-U25 = signpost:TS3USB30E: USB Mux with OE control and ESD; DIGIKEY: 296-24684-1-ND
U26-U31 = signpost:MCP23008: GPIO Extender via I2C - 8 Pin; DIGIKEY: MCP23008T-E/SOCT-ND
Y1 = crystals:ABMM: Low-Profile SMD crystal; DIGIKEY: 535-10156-1-ND